# Altium project 2m_DBoard_TX.PrjPcb (part 1 of 2)
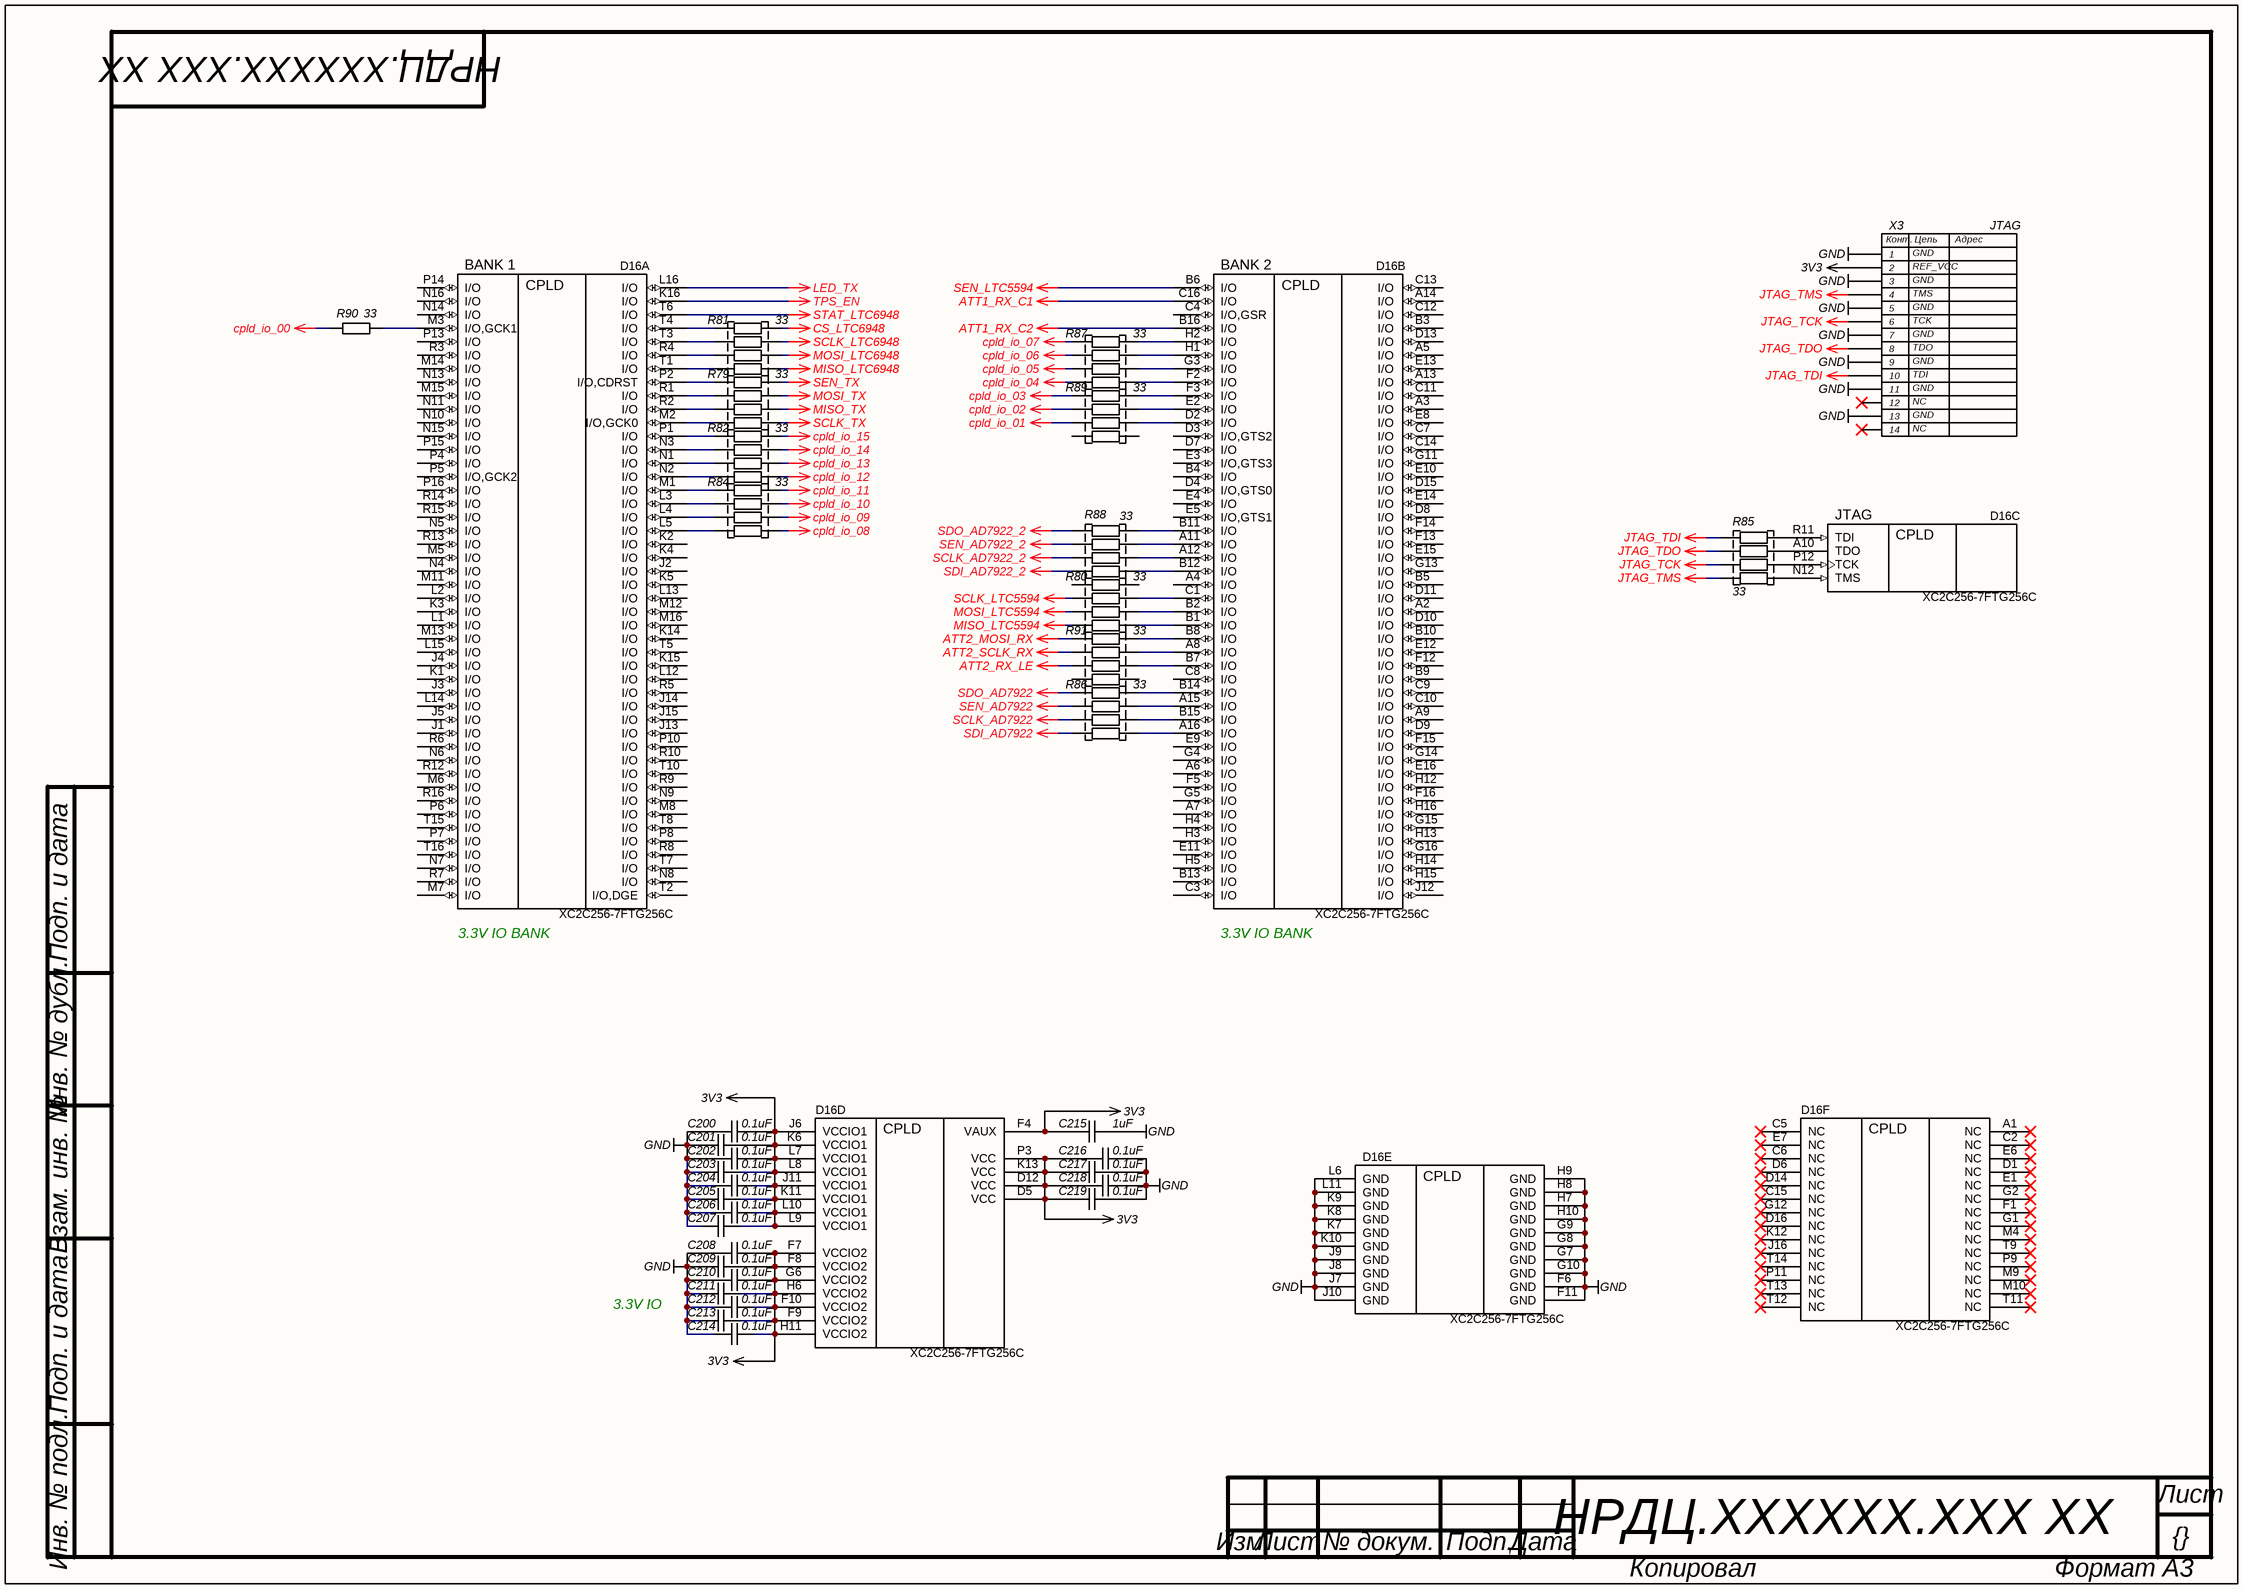
[diagram p0: CPLD.SchDoc]
7 sheets, 280 parts. Net scope: global (net labels, ports and power ports of the same name join across sheets).
Board file: 2m_DBoard_TX.PcbDoc
Sheets:
  CPLD.SchDoc
  DBoard_conn.SchDoc
  IF_TX.SchDoc
  TX.SchDoc
  REFCLK.SchDoc
  Digital.SchDoc
  Power.SchDoc

## Sheet CPLD.SchDoc: {Наименование}
size 420 x 297 mm; DocumentNumber: НРДЦ.ХХХХХХ.ХХХ ХХ; SheetNumber: {}; SheetTotal: {}; PageSetup: Record=PageOptions|CenterHorizontal=False|CenterVertical=False|PrintScale=0.95|XCorrection=0.00|YCorrection=0.00|PrintKind=1|BorderSize=5000000|LeftOffset=0|BottomOffset=0|Orientation=1|PaperLength=1000|PaperWidth=1000|Scale=100|PaperSource=15|PrintQuality=600|MediaType=1|DitherType=10|PaperKind=A4|PrintScaleMode=1; Rule: PcbType=ProtelPcb

### Parts
(Parts that share a designator on the sheet are numbered #1, #2 ... from top to bottom, then left to right.)
C200  value 0.1uF  [C0402]  (hidden comment: CAP)
C201  value 0.1uF  [C0402]  (hidden comment: CAP)
C202#1  value 0.1uF  [C0402]  (hidden comment: CAP)
C203#1  value 0.1uF  [C0402]  (hidden comment: CAP)
C204  value 0.1uF  [C0402]  (hidden comment: CAP)
C205  value 0.1uF  [C0402]  (hidden comment: CAP)
C206  value 0.1uF  [C0402]  (hidden comment: CAP)
C207  value 0.1uF  [C0402]  (hidden comment: CAP)
C208  value 0.1uF  [C0402]  (hidden comment: CAP)
C209  value 0.1uF  [C0402]  (hidden comment: CAP)
C210#1  value 0.1uF  [C0402]  (hidden comment: CAP)
C211#1  value 0.1uF  [C0402]  (hidden comment: CAP)
C212#1  value 0.1uF  [C0402]  (hidden comment: CAP)
C213  value 0.1uF  [C0402]  (hidden comment: CAP)
C214  value 0.1uF  [C0402]  (hidden comment: CAP)
C215  value 1uF  [C0402]  (hidden comment: CAP)
C216  value 0.1uF  [C0402]  (hidden comment: CAP)
C217  value 0.1uF  [C0402]  (hidden comment: CAP)
C218  value 0.1uF  [C0402]  (hidden comment: CAP)
C219  value 0.1uF  [C0402]  (hidden comment: CAP)
D16  XC2C256-7FTG256C  [FTG256]  (parts A,B,C,D,E,F of 6)
R79  value 33  [EXN8V]  (hidden comment: RES 4x0402)
R80  value 33  [EXN8V]  (hidden comment: RES 4x0402)
R81  value 33  [EXN8V]  (hidden comment: RES 4x0402)
R82  value 33  [EXN8V]  (hidden comment: RES 4x0402)
R84  value 33  [EXN8V]  (hidden comment: RES 4x0402)
R85  value 33  [EXN8V]  (hidden comment: RES 4x0402)
R86  value 33  [EXN8V]  (hidden comment: RES 4x0402)
R87  value 33  [EXN8V]  (hidden comment: RES 4x0402)
R88  value 33  [EXN8V]  (hidden comment: RES 4x0402)
R89  value 33  [EXN8V]  (hidden comment: RES 4x0402)
R90  value 33  [R0402]  (hidden comment: RES)
R91  value 33  [EXN8V]  (hidden comment: RES 4x0402)
X3  JTAG  [JTAG Mail 2mm]

### Nets
3V3: C200.2 C201.2 C202#1.2 C203#1.2 C204.2 C205.2 C206.2 C207.2 C208.2 C209.2 C210#1.2 C211#1.2 C212#1.2 C213.2 C214.2 C215.1 C216.1 C217.1 C218.1 C219.1 D16.D5(VCC) D16.D12(VCC) D16.F4(VAUX) D16.F7(VCCIO2) D16.F8(VCCIO2) D16.F9(VCCIO2) D16.F10(VCCIO2) D16.G6(VCCIO2) D16.H6(VCCIO2) D16.H11(VCCIO2) D16.J6(VCCIO1) D16.J11(VCCIO1) D16.K6(VCCIO1) D16.K11(VCCIO1) D16.K13(VCC) D16.L7(VCCIO1) D16.L8(VCCIO1) D16.L9(VCCIO1) D16.L10(VCCIO1) D16.P3(VCC) X3.2
ATT1_RX_C1: D16.C16(I/O)
ATT1_RX_C2: D16.B16(I/O)
ATT2_MOSI_RX: R91.5
ATT2_RX_LE: R91.7
ATT2_SCLK_RX: R91.6
cpld_io_00: R90.2
cpld_io_01: R89.6
cpld_io_02: R89.7
cpld_io_03: R89.8
cpld_io_04: R87.5
cpld_io_05: R87.6
cpld_io_06: R87.7
cpld_io_07: R87.8
cpld_io_08: R84.5
cpld_io_09: R84.6
cpld_io_10: R84.7
cpld_io_11: R84.8
cpld_io_12: R82.5
cpld_io_13: R82.6
cpld_io_14: R82.7
cpld_io_15: R82.8
CS_LTC6948: R81.8
GND: C200.1 C201.1 C202#1.1 C203#1.1 C204.1 C205.1 C206.1 C207.1 C208.1 C209.1 C210#1.1 C211#1.1 C212#1.1 C213.1 C214.1 C215.2 C216.2 C217.2 C218.2 C219.2 D16.F6(GND) D16.F11(GND) D16.G7(GND) D16.G8(GND) D16.G9(GND) D16.G10(GND) D16.H7(GND) D16.H8(GND) D16.H9(GND) D16.H10(GND) D16.J7(GND) D16.J8(GND) D16.J9(GND) D16.J10(GND) D16.K7(GND) D16.K8(GND) D16.K9(GND) D16.K10(GND) D16.L6(GND) D16.L11(GND) X3.1 X3.3 X3.5 X3.7 X3.9 X3.11 X3.13
JTAG_TCK: R85.6 X3.6
JTAG_TDI: R85.8 X3.10
JTAG_TDO: R85.7 X3.8
JTAG_TMS: R85.5 X3.4
LED_TX: D16.L16(I/O)
MISO_LTC5594: R80.5
MISO_LTC6948: R81.5
MISO_TX: R79.7
MOSI_LTC5594: R80.6
MOSI_LTC6948: R81.6
MOSI_TX: R79.6
SCLK_AD7922: R86.2
SCLK_AD7922_2: R88.6
SCLK_LTC5594: R80.7
SCLK_LTC6948: R81.7
SCLK_TX: R79.8
SDI_AD7922: R86.1
SDI_AD7922_2: R88.5
SDO_AD7922: R86.4
SDO_AD7922_2: R88.8
SEN_AD7922: R86.3
SEN_AD7922_2: R88.7
SEN_LTC5594: D16.B6(I/O)
SEN_TX: R79.5
STAT_LTC6948: D16.T6(I/O)
TPS_EN: D16.K16(I/O)
NetD16_A8: D16.A8(I/O) R91.3
NetD16_A10: D16.A10(TDO) R85.2
NetD16_A11: D16.A11(I/O) R88.1
NetD16_A12: D16.A12(I/O) R88.3
NetD16_A15: D16.A15(I/O) R86.6
NetD16_A16: D16.A16(I/O) R86.8
NetD16_B1: D16.B1(I/O) R80.4
NetD16_B2: D16.B2(I/O) R80.3
NetD16_B7: D16.B7(I/O) R91.2
NetD16_B8: D16.B8(I/O) R91.4
NetD16_B11: D16.B11(I/O) R88.2
NetD16_B12: D16.B12(I/O) R88.4
NetD16_B14: D16.B14(I/O) R86.5
NetD16_B15: D16.B15(I/O) R86.7
NetD16_C1: D16.C1(I/O) R80.2
NetD16_D2: D16.D2(I/O) R89.3
NetD16_E2: D16.E2(I/O) R89.2
NetD16_F2: D16.F2(I/O) R87.4
NetD16_F3: D16.F3(I/O) R89.1
NetD16_G3: D16.G3(I/O) R87.3
NetD16_H1: D16.H1(I/O) R87.2
NetD16_H2: D16.H2(I/O) R87.1
NetD16_L3: D16.L3(I/O) R84.2
NetD16_L4: D16.L4(I/O) R84.3
NetD16_L5: D16.L5(I/O) R84.4
NetD16_M1: D16.M1(I/O) R84.1
NetD16_M2: D16.M2(I/O,GCK0) R79.1
NetD16_M3: D16.M3(I/O,GCK1) R90.1
NetD16_N1: D16.N1(I/O) R82.3
NetD16_N2: D16.N2(I/O) R82.4
NetD16_N3: D16.N3(I/O) R82.2
NetD16_N12: D16.N12(TMS) R85.4
NetD16_P1: D16.P1(I/O) R82.1
NetD16_P2: D16.P2(I/O,CDRST) R79.4
NetD16_P12: D16.P12(TCK) R85.3
NetD16_R1: D16.R1(I/O) R79.3
NetD16_R2: D16.R2(I/O) R79.2
NetD16_R4: D16.R4(I/O) R81.2
NetD16_R11: D16.R11(TDI) R85.1
NetD16_T1: D16.T1(I/O) R81.4
NetD16_T3: D16.T3(I/O) R81.3
NetD16_T4: D16.T4(I/O) R81.1

Not connected (* = marked no-connect by the designer): D16 A1(NC)* A2(I/O) A3(I/O) A4(I/O) A5(I/O) A6(I/O) A7(I/O) A9(I/O) A13(I/O) A14(I/O) B3(I/O) B4(I/O) B5(I/O) B9(I/O) B10(I/O) B13(I/O) C2(NC)* C3(I/O) C4(I/O,GSR) C5(NC)* C6(NC)* C7(I/O) C8(I/O) C9(I/O) C10(I/O) C11(I/O) C12(I/O) C13(I/O) C14(I/O) C15(NC)* D1(NC)* D3(I/O,GTS2) D4(I/O,GTS0) D6(NC)* D7(I/O) D8(I/O) D9(I/O) D10(I/O) D11(I/O) D13(I/O) D14(NC)* D15(I/O) D16(NC)* E1(NC)* E3(I/O,GTS3) E4(I/O) E5(I/O,GTS1) E6(NC)* E7(NC)* E8(I/O) E9(I/O) E10(I/O) E11(I/O) E12(I/O) E13(I/O) E14(I/O) E15(I/O) E16(I/O) F1(NC)* F5(I/O) F12(I/O) F13(I/O) F14(I/O) F15(I/O) F16(I/O) G1(NC)* G2(NC)* G4(I/O) G5(I/O) G11(I/O) G12(NC)* G13(I/O) G14(I/O) G15(I/O) G16(I/O) H3(I/O) H4(I/O) H5(I/O) H12(I/O) H13(I/O) H14(I/O) H15(I/O) H16(I/O) J1(I/O) J2(I/O) J3(I/O) J4(I/O) J5(I/O) J12(I/O) J13(I/O) J14(I/O) J15(I/O) J16(NC)* K1(I/O) K2(I/O) K3(I/O) K4(I/O) K5(I/O) K12(NC)* K14(I/O) K15(I/O) L1(I/O) L2(I/O) L12(I/O) L13(I/O) L14(I/O) L15(I/O) M4(NC)* M5(I/O) M6(I/O) M7(I/O) M8(I/O) M9(NC)* M10(NC)* M11(I/O) M12(I/O) M13(I/O) M14(I/O) M15(I/O) M16(I/O) N4(I/O) N5(I/O) N6(I/O) N7(I/O) N8(I/O) N9(I/O) N10(I/O) N11(I/O) N13(I/O) N14(I/O) N15(I/O) N16(I/O) P4(I/O) P5(I/O,GCK2) P6(I/O) P7(I/O) P8(I/O) P9(NC)* P10(I/O) P11(NC)* P13(I/O) P14(I/O) P15(I/O) P16(I/O) R3(I/O) R5(I/O) R6(I/O) R7(I/O) R8(I/O) R9(I/O) R10(I/O) R12(I/O) R13(I/O) R14(I/O) R15(I/O) R16(I/O) T2(I/O,DGE) T5(I/O) T7(I/O) T8(I/O) T9(NC)* T10(I/O) T11(NC)* T12(NC)* T13(NC)* T14(NC)* T15(I/O) T16(I/O); R80 1 8; R89 4 5; R91 1 8; X3 12* 14*

### Notes on the sheet
- (near X3) GND
- (near X3) REF_VCC
- (near X3) TMS
- (near X3) TCK
- (near X3) TDO
- (near X3) TDI
- (near X3) NC
- (near D16) 3.3V IO BANK
- 3.3V IO
- Подп. и дата
- Инв. № дубл.
- Взам. инв. №
- Инв. № подл.
- Лист
- Изм.
- № докум.
- Подп.
- Дата
- Копировал
- Формат А3
- (in symbol HDR Debug_14-pin) Конт.; Цепь; Адрес
- (in symbol XC2C256-7FTG256C, part A) BANK 1
- (in symbol XC2C256-7FTG256C, part B) BANK 2
- (in symbol XC2C256-7FTG256C, part C) JTAG

### Library data of the parts
C200 C204 C208 C210#1 C212#1 C214 C216-C219 = CAP: SMD Capacitor; Manufacturer: Murata; Material: X7R; Tolerance: 10%; Voltage: 16V; Type: Ceramic Capacitor; P/N: GRM155R71C104KA88J
C201 C202#1 C203#1 C205-C207 C209 C211#1 C213 C215 = CAP: SMD Capacitor; Manufacturer: Murata; Material: X7R; Tolerance: 10%; Voltage: 6.3V; Type: Ceramic Capacitor; P/N: GRM155R70J105KA12J
D16 = XC2C256-7FTG256C: CoolRunner-II 1.8V, 256 Macrocell CPLD, 184 User I/Os, 256-Ball FTBGA, Commercial Grade, Pb-Free; Code_JEDEC: MS-034-AAF-1*; PackageVersion: ver1.3, Oct-2007; PackageReference: FTG256; PackageDescription: 256-Ball Fine Pitch Thin Ball Grid Array 1.00 mm Pitch (FTG256) - Pb-Free; DatasheetVersion: ver3.2, Mar-2007; PartNumber: XC2C256-7FTG256C; P/N: XC2C256-7FTG256C; Name: XC2C256-7FTG256C; Type: CPLD
R79-R82 R84-R89 R91 = RES 4x0402: Chip Resistor Array; Manufacturer: Panasonic; Name: EXBN8V; Number of Resistors: 4; Tolerance: 5%; P/N: ERJ-2GEJ330X; Type: 0402 Array Concave Terminal; Number of Terminals: 8; Series: EXB
R90 = RES: SMD Resistor; Manufacturer: Panasonic Electronic Components; Name: Chip SMD Resistor; Power: 0.2 Wt; P/N: ERJ-2RKF28R7X; Temperature Range: -55…155°C
X3 = HDR Debug_14-pin: 2.00mm Pitch, Milli-Grid PCB Header, Dual Row, Vertical, Through Hole, Shrouded, 14 / Circuits; Manufacturer: Molex; Name: Milli-Grid Connector System; P/N: 878311421; Type: 2.00mm Pitch, Milli-Grid PCB Header, Dual Row, Vertical, Through Hole, Shrouded, 14; Series: 87831

## Sheet DBoard_conn.SchDoc: {Наименование}
size 420 x 297 mm; DocumentNumber: ПЛАС.ХХХХХХ.ХХХ ХХ; SheetNumber: {}; SheetTotal: {}; PageSetup: Record=PageOptions|CenterHorizontal=False|CenterVertical=False|PrintScale=0.95|XCorrection=0.00|YCorrection=0.00|PrintKind=1|BorderSize=5000000|LeftOffset=0|BottomOffset=0|Orientation=1|PaperLength=1000|PaperWidth=1000|Scale=100|PaperSource=15|PrintQuality=600|MediaType=1|DitherType=10|PaperKind=A4|PrintScaleMode=1; Rule: PcbType=ProtelPcb
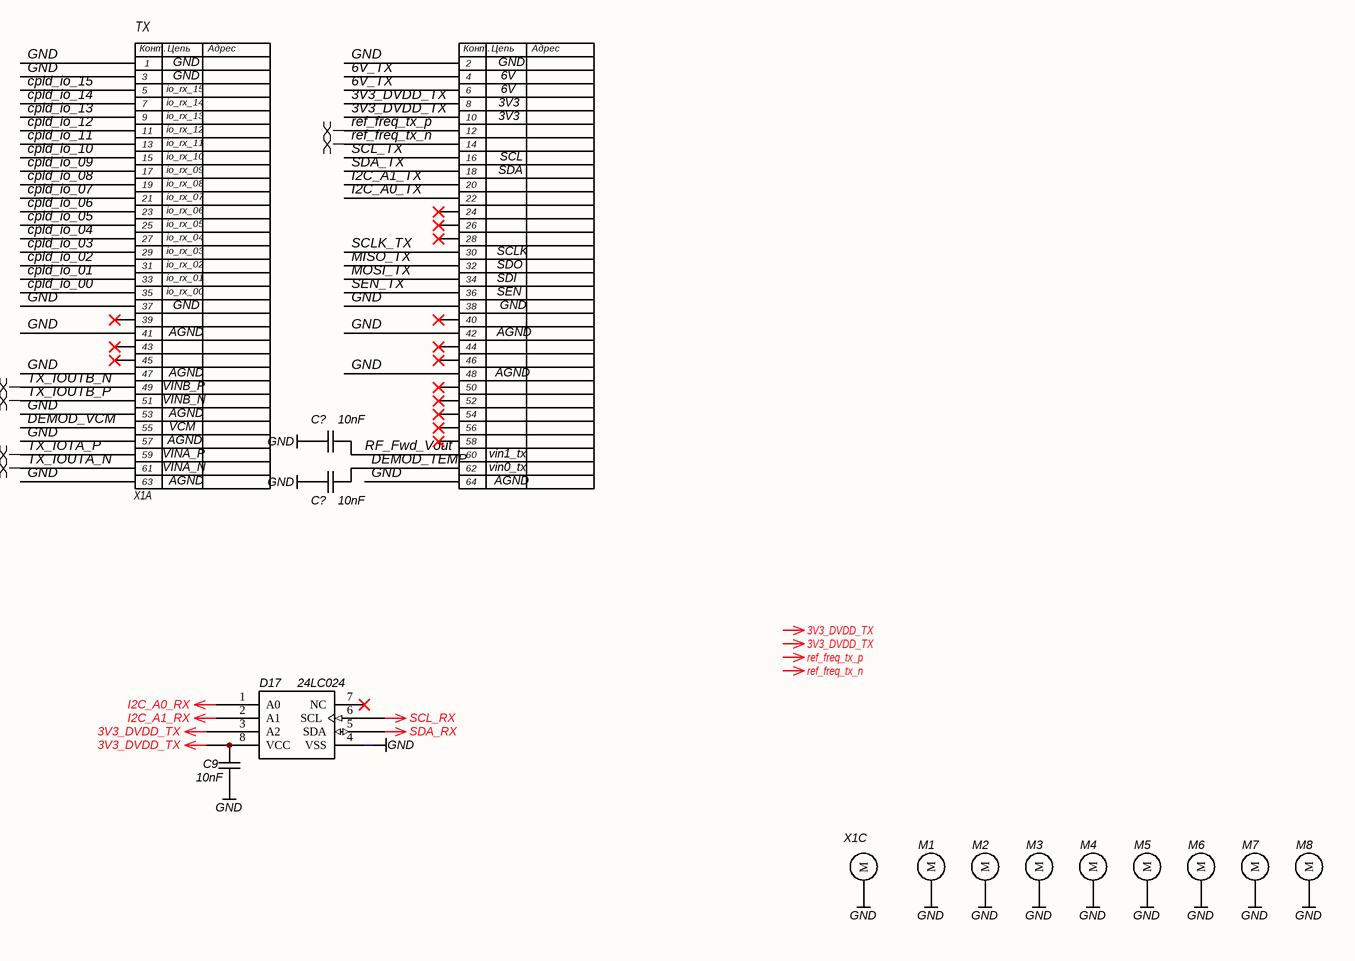
[diagram p1: DBoard_conn.SchDoc]

### Parts
(Parts that share a designator on the sheet are numbered #1, #2 ... from top to bottom, then left to right.)
C9  value 10nF  [C0402]  (hidden comment: CAP)
C?#1  value 10nF  [C0402]  (hidden comment: CAP)
C?#2  value 10nF  [C0402]  (hidden comment: CAP)
D17#1  24LC024  [SOIC_SN8]
M1  Via  [Mechanical_Via_2.6x4.2]  (value not drawn)
M2  Via  [Mechanical_Via_2.6x4.2]  (value not drawn)
M3  Via  [Mechanical_Via_2.6x4.2]  (value not drawn)
M4  Via  [Mechanical_Via_2.6x4.2]  (value not drawn)
M5  Via  [Mechanical_Via_2.6x4.2]  (value not drawn)
M6  Via  [Mechanical_Via_2.6x4.2]  (value not drawn)
M7  Via  [Mechanical_Via_2.6x4.2]  (value not drawn)
M8  Via  [Mechanical_Via_2.6x4.2]  (value not drawn)
X1  DBoard  [DBOARD-HALF-TX-MB]  (value not drawn)  (parts A,C of 3)

### Nets
3V3_DVDD_TX: C9.2 D17#1.3(A2) D17#1.8(VCC) X1.8 X1.10
6V_TX: X1.4 X1.6
cpld_io_00: X1.35
cpld_io_01: X1.33
cpld_io_02: X1.31
cpld_io_03: X1.29
cpld_io_04: X1.27
cpld_io_05: X1.25
cpld_io_06: X1.23
cpld_io_07: X1.21
cpld_io_08: X1.19
cpld_io_09: X1.17
cpld_io_10: X1.15
cpld_io_11: X1.13
cpld_io_12: X1.11
cpld_io_13: X1.9
cpld_io_14: X1.7
cpld_io_15: X1.5
GND: C9.1 C?#1.1 C?#2.1 D17#1.4(VSS) M1.0(M) M2.0(M) M3.0(M) M4.0(M) M5.0(M) M6.0(M) M7.0(M) M8.0(M) X1.0(M) X1.1 X1.2 X1.3 X1.37 X1.38 X1.41 X1.42 X1.47 X1.48 X1.53 X1.57 X1.63 X1.64
I2C_A0_RX: D17#1.1(A0)
I2C_A0_TX: X1.22
I2C_A1_RX: D17#1.2(A1)
I2C_A1_TX: X1.20
MISO_TX: X1.32
MOSI_TX: X1.34
ref_freq_tx_n: X1.14
ref_freq_tx_p: X1.12
SCL_RX: D17#1.6(SCL)
SCL_TX: X1.16
SCLK_TX: X1.30
SDA_RX: D17#1.5(SDA)
SDA_TX: X1.18
SEN_TX: X1.36
TX_IOUTA_N: X1.61
TX_IOUTB_N: X1.49
TX_IOUTB_P: X1.51
DEMOD_TEMP: C?#2.2 X1.62
DEMOD_VCM: X1.55
RF_Fwd_Vout: C?#1.2 X1.60
TX_IOTA_P: X1.59

Not connected (* = marked no-connect by the designer): D17#1 7(NC)*; X1 24* 26* 28* 39* 40* 43* 44* 45* 46* 50* 52* 54* 56* 58*

### Layout directives
differential pair: ref_freq_tx_n, ref_freq_tx_p, TX_IOTA_P, TX_IOUTA_N, TX_IOUTB_N, TX_IOUTB_P

### Notes on the sheet
- (near X1) io_rx_15
- (near X1) io_rx_14
- (near X1) GND
- (near X1) 3V3
- (near X1) 6V
- (near X1) io_rx_13
- (near X1) io_rx_12
- (near X1) io_rx_11
- (near X1) io_rx_10
- (near X1) io_rx_09
- (near X1) SDA
- (near X1) SCL
- (near X1) io_rx_08
- (near X1) io_rx_07
- (near X1) io_rx_06
- (near X1) io_rx_05
- (near X1) io_rx_04
- (near X1) io_rx_03
- (near X1) io_rx_02
- (near X1) io_rx_01
- (near X1) io_rx_00
- (near X1) SCLK
- (near X1) SDO
- (near X1) SDI
- (near X1) SEN
- (near X1) AGND
- (near X1) VINB_P
- (near X1) VINB_N
- (near X1) VCM
- (near X1) VINA_P
- (near X1) VINA_N
- (near X1) vin1_tx
- (near X1) vin0_tx
- Labels drawn without touching a wire or pin: 3V3_DVDD_TX, ref_freq_tx_n, ref_freq_tx_p
- Подп. и дата
- Инв. № дубл.
- Взам. инв. №
- Инв. № подл.
- Лист
- Изм.
- № докум.
- Подп.
- Дата
- Копировал
- Формат А3
- (in symbol DBoard, part A) TX; Конт.; Цепь; Адрес
- (in symbol DBoard, part B) RX; Конт.; Цепь; Адрес

### Library data of the parts
C9 C?#1 C?#2 = CAP: SMD Capacitor; Manufacturer: Murata; Material: X7R; Tolerance: 10%; Voltage: 25V; Type: Ceramic Capacitor; P/N: GRM155R71E103KA01D
D17#1 = 24LC024: I2C EEPROM; Manufacturer: Microchip; Capacity: 2kbit; Max Clock: 400 kHz; Voltage: 2.5-5.5V; P/N: 24LC024HT-I/SN; Name: 24LC024; Package: SOIC-8; Type: I2C EEPROM; Value: 24LC024
M1-M8 = Mechanical Via
X1 = DBoard: USRP DBoard; Manufacturer: Molex; Name: 1.00mm Pitch Mezzanine 714390164; P/N: 714390164; Supplier 1: Digi-Key; Supplier Part Number 1: WM17201-ND

## Sheet IF_TX.SchDoc: {Наименование}
size 420 x 297 mm; DocumentNumber: ПЛАС.ХХХХХХ.ХХХ ХХ; SheetNumber: {}; SheetTotal: {}; PageSetup: Record=PageOptions|CenterHorizontal=False|CenterVertical=False|PrintScale=0.95|XCorrection=0.00|YCorrection=0.00|PrintKind=1|BorderSize=5000000|LeftOffset=0|BottomOffset=0|Orientation=1|PaperLength=1000|PaperWidth=1000|Scale=100|PaperSource=15|PrintQuality=600|MediaType=1|DitherType=10|PaperKind=A4|PrintScaleMode=1; Rule: PcbType=ProtelPcb
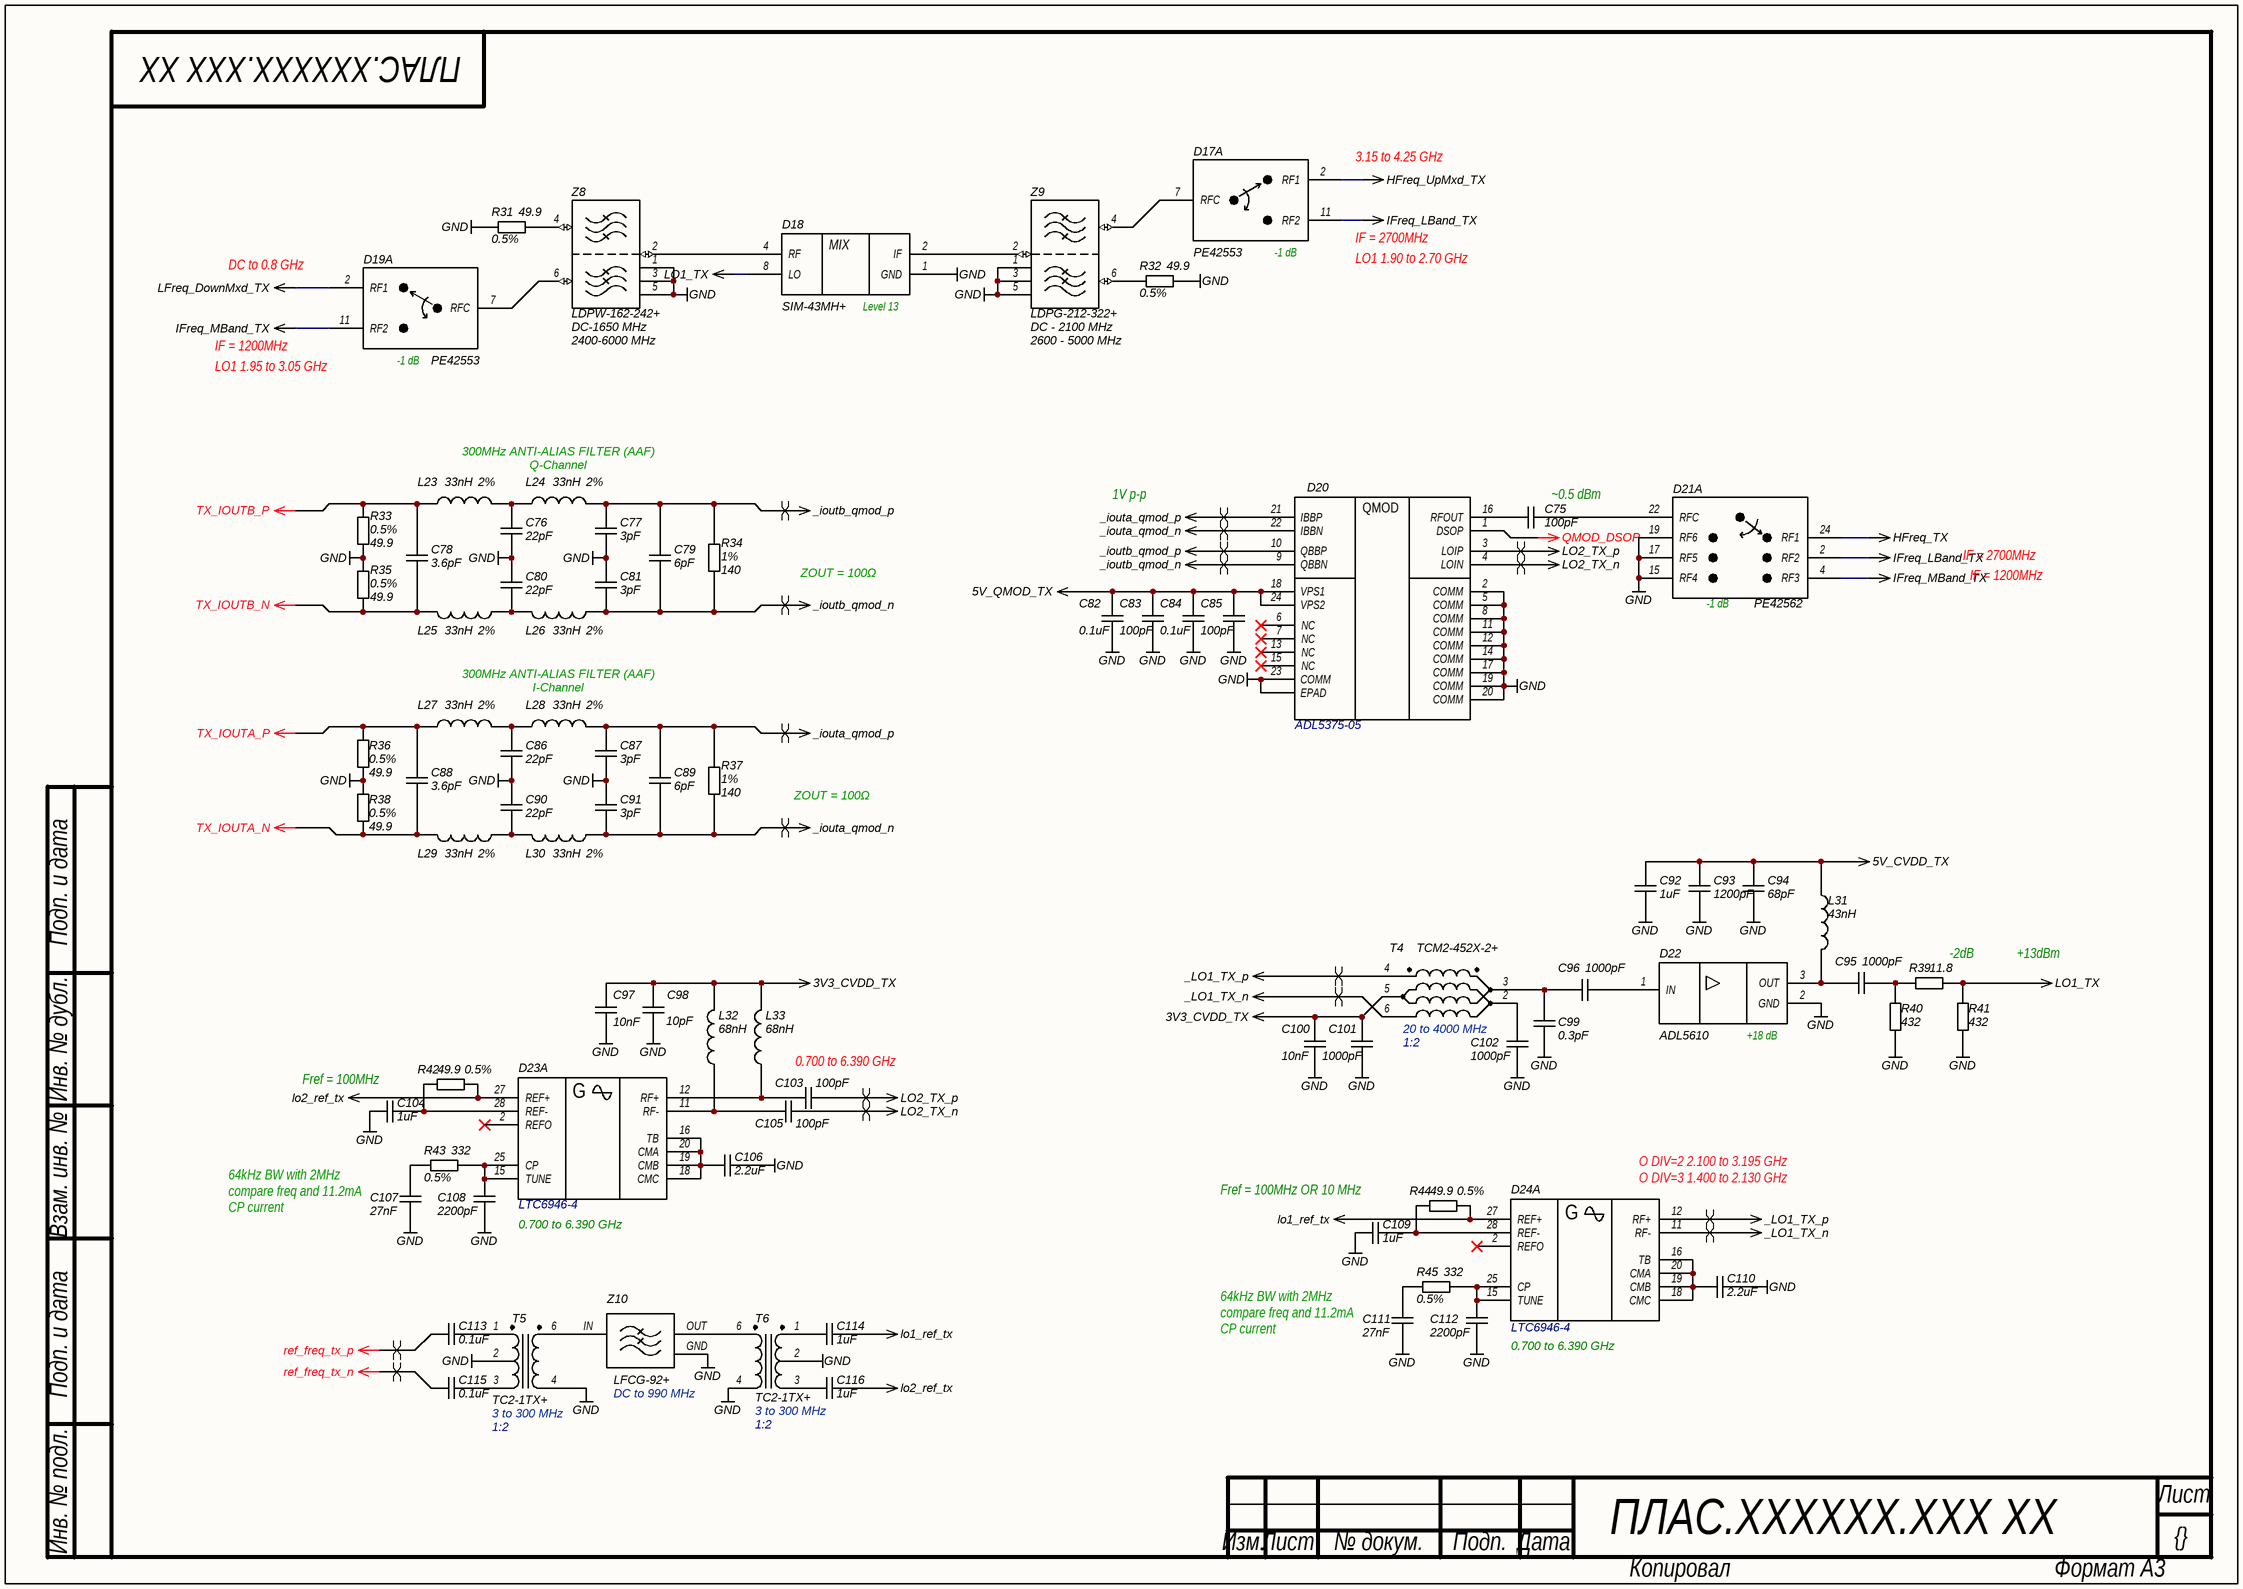
[diagram p2: IF_TX.SchDoc]

### Parts
(Parts that share a designator on the sheet are numbered #1, #2 ... from top to bottom, then left to right.)
C75  value 100pF  [C0402]  (hidden comment: CAP)
C76  value 22pF  [C0402]  (hidden comment: CAP)
C77  value 3pF  [C0402]  (hidden comment: CAP)
C78  value 3.6pF  [C0402]  (hidden comment: CAP)
C79  value 6pF  [C0402]  (hidden comment: CAP)
C80  value 22pF  [C0402]  (hidden comment: CAP)
C81  value 3pF  [C0402]  (hidden comment: CAP)
C82  value 0.1uF  [C0402]  (hidden comment: CAP)
C83  value 100pF  [C0402]  (hidden comment: CAP)
C84  value 0.1uF  [C0402]  (hidden comment: CAP)
C85  value 100pF  [C0402]  (hidden comment: CAP)
C86  value 22pF  [C0402]  (hidden comment: CAP)
C87  value 3pF  [C0402]  (hidden comment: CAP)
C88  value 3.6pF  [C0402]  (hidden comment: CAP)
C89  value 6pF  [C0402]  (hidden comment: CAP)
C90  value 22pF  [C0402]  (hidden comment: CAP)
C91  value 3pF  [C0402]  (hidden comment: CAP)
C92  value 1uF  [C0805]  (hidden comment: CAP)
C93  value 1200pF  [C0603]  (hidden comment: CAP)
C94  value 68pF  [C0402]  (hidden comment: CAP)
C95  value 1000pF  [C0402]  (hidden comment: CAP)
C96  value 1000pF  [C0402]  (hidden comment: CAP)
C97  value 10nF  [C0402]  (hidden comment: CAP)
C98  value 10pF  [C0402]  (hidden comment: CAP)
C99  value 0.3pF  [C0402]  (hidden comment: CAP)
C100  value 10nF  [C0402]  (hidden comment: CAP)
C101  value 1000pF  [C0402]  (hidden comment: CAP)
C102  value 1000pF  [C0402]  (hidden comment: CAP)
C103  value 100pF  [C0402]  (hidden comment: CAP)
C104  value 1uF  [C0805]  (hidden comment: CAP)
C105  value 100pF  [C0402]  (hidden comment: CAP)
C106  value 2.2uF  [C0603]  (hidden comment: CAP)
C107  value 27nF  [C1206]  (hidden comment: CAP)
C108  value 2200pF  [C0603]  (hidden comment: CAP)
C109  value 1uF  [C0805]  (hidden comment: CAP)
C110  value 2.2uF  [C0603]  (hidden comment: CAP)
C111  value 27nF  [C1206]  (hidden comment: CAP)
C112  value 2200pF  [C0603]  (hidden comment: CAP)
C113  value 0.1uF  [C0402]  (hidden comment: CAP)
C114  value 1uF  [C0805]  (hidden comment: CAP)
C115  value 0.1uF  [C0402]  (hidden comment: CAP)
C116  value 1uF  [C0805]  (hidden comment: CAP)
D17#2  PE42553  [QFN-16]  (part A of 2)
D18  SIM-43MH+  [SIM-43MH+]
D19  PE42553  [QFN-16]  (part A of 2)
D20  Name: ADL5375-05  [LFCSP-24]  (hidden comment: ADL5375)
D21  PE42562  [QFN-24]  (part A of 2)
D22  ADL5610  [ADL5610]
D23  Name: LTC6946-4  Frequency Range: 0.700 to 6.390 GHz  [QFN-28]  (hidden comment: LTC6946)  (part A of 2)
D24  Name: LTC6946-4  Frequency Range: 0.700 to 6.390 GHz  [QFN-28]  (hidden comment: LTC6946)  (part A of 2)
L23  value 33nH  Tolerance: 2%  [L0603_HP]  (hidden comment: Inductor RF)
L24  value 33nH  Tolerance: 2%  [L0603_HP]  (hidden comment: Inductor RF)
L25  value 33nH  Tolerance: 2%  [L0603_HP]  (hidden comment: Inductor RF)
L26  value 33nH  Tolerance: 2%  [L0603_HP]  (hidden comment: Inductor RF)
L27  value 33nH  Tolerance: 2%  [L0603_HP]  (hidden comment: Inductor RF)
L28  value 33nH  Tolerance: 2%  [L0603_HP]  (hidden comment: Inductor RF)
L29  value 33nH  Tolerance: 2%  [L0603_HP]  (hidden comment: Inductor RF)
L30  value 33nH  Tolerance: 2%  [L0603_HP]  (hidden comment: Inductor RF)
L31  value 43nH  [L0603_HP]  (hidden comment: Inductor RF)
L32  value 68nH  [L0603_HP]  (hidden comment: Inductor RF)
L33  value 68nH  [L0603_HP]  (hidden comment: Inductor RF)
R31  value 49.9  Tolerance: 0.5%  [R0402]  (hidden comment: RES)
R32  value 49.9  Tolerance: 0.5%  [R0402]  (hidden comment: RES)
R33  value 49.9  Tolerance: 0.5%  [R0402]  (hidden comment: RES)
R34  value 140  Tolerance: 1%  [R0402]  (hidden comment: RES)
R35  value 49.9  Tolerance: 0.5%  [R0402]  (hidden comment: RES)
R36  value 49.9  Tolerance: 0.5%  [R0402]  (hidden comment: RES)
R37  value 140  Tolerance: 1%  [R0402]  (hidden comment: RES)
R38  value 49.9  Tolerance: 0.5%  [R0402]  (hidden comment: RES)
R39  value 11.8  [R0402]  (hidden comment: RES)
R40  value 432  [R0402]  (hidden comment: RES)
R41  value 432  [R0402]  (hidden comment: RES)
R42  value 49.9  Tolerance: 0.5%  [R0402]  (hidden comment: RES)
R43  value 332  Tolerance: 0.5%  [R0603]  (hidden comment: RES)
R44  value 49.9  Tolerance: 0.5%  [R0402]  (hidden comment: RES)
R45  value 332  Tolerance: 0.5%  [R0603]  (hidden comment: RES)
T4  TCM2-452X-2+  Frequency: 20 to 4000 MHz  Ratio: 1:2  [DB1627]
T5  TC2-1TX+  Frequency: 3 to 300 MHz  Ratio: 1:2  [AT1521]
T6  TC2-1TX+  Frequency: 3 to 300 MHz  Ratio: 1:2  [AT1521]
Z8  LDPW-162-242+  Low Pass: DC-1650 MHz  High Pass: 2400-6000 MHz  [JC0603C]
Z9  LDPG-212-322+  Low Pass: DC - 2100 MHz  High Pass: 2600 - 5000 MHz  [GE0805C-10]
Z10  LFCG-92+  Frequency: DC to 990 MHz  [GE0805C-2]

### Nets
3V3_CVDD_TX: C97.2 C98.2 C100.2 C101.1 L32.2 L33.2 T4.5
5V_CVDD_TX: C92.1 C93.2 C94.2 L31.2
5V_QMOD_TX: C82.2 C83.2 C84.2 C85.2 D20.18(VPS1) D20.24(VPS2)
_iouta_qmod_n: C89.2 C91.2 D20.22(IBBN) L30.2 R37.2
_iouta_qmod_p: C87.1 C89.1 D20.21(IBBP) L28.2 R37.1
_ioutb_qmod_n: C79.2 C81.2 D20.9(QBBN) L26.2 R34.2
_ioutb_qmod_p: C77.1 C79.1 D20.10(QBBP) L24.2 R34.1
_LO1_TX_n: D24.11(RF-) T4.6
_LO1_TX_p: D24.12(RF+) T4.4
GND: C76.2 C77.2 C80.1 C81.1 C82.1 C83.1 C84.1 C85.1 C86.2 C87.2 C90.1 C91.1 C92.2 C93.1 C94.1 C97.1 C98.1 C99.1 C100.1 C101.2 C102.2 C104.2 C106.1 C107.1 C108.1 C109.2 C110.1 C111.1 C112.1 D18.1(GND) D20.2(COMM) D20.5(COMM) D20.8(COMM) D20.11(COMM) D20.12(COMM) D20.14(COMM) D20.17(COMM) D20.19(COMM) D20.20(COMM) D20.23(COMM) D20.25(EPAD) D21.15(RF4) D21.17(RF5) D21.19(RF6) D22.2(GND) R31.1 R32.1 R33.2 R35.1 R36.2 R38.1 R40.2 R41.2 T5.2 T5.4 T6.2 T6.4 Z8.1(GND) Z8.3(GND) Z8.5(GND) Z9.1(GND) Z9.3(GND) Z9.5(GND) Z10.GND
HFreq_TX: D21.24(RF1)
HFreq_UpMxd_TX: D17#2.2(RF1)
IFreq_LBand_TX: D17#2.11(RF2) D21.2(RF2)
IFreq_MBand_TX: D19.11(RF2) D21.4(RF3)
LFreq_DownMxd_TX: D19.2(RF1)
lo1_ref_tx: C114.1 D24.27(REF+) R44.1
LO1_TX: D18.8(LO) R39.1 R41.1
lo2_ref_tx: C116.1 D23.27(REF+) R42.1
LO2_TX_n: C105.2 D20.4(LOIN)
LO2_TX_p: C103.2 D20.3(LOIP)
QMOD_DSOP: D20.1(DSOP)
ref_freq_tx_n: C115.2
ref_freq_tx_p: C113.2
TX_IOUTA_N: C88.2 L29.1 R38.2
TX_IOUTA_P: C88.1 L27.1 R36.1
TX_IOUTB_N: C78.2 L25.1 R35.2
TX_IOUTB_P: C78.1 L23.1 R33.1
NetC75_1: C75.1 D20.16(RFOUT)
NetC75_2: C75.2 D21.22(RFC)
NetC76_1: C76.1 L23.2 L24.1
NetC80_2: C80.2 L25.2 L26.1
NetC86_1: C86.1 L27.2 L28.1
NetC90_2: C90.2 L29.2 L30.1
NetC95_1: C95.1 D22.3(OUT) L31.1
NetC95_2: C95.2 R39.2 R40.1
NetC96_1: C96.1 C99.2 T4.3
NetC96_2: C96.2 D22.1(IN)
NetC102_1: C102.1 T4.2
NetC103_1: C103.1 D23.12(RF+) L33.1
NetC104_1: C104.1 D23.28(REF-) R42.2
NetC105_1: C105.1 D23.11(RF-) L32.1
NetC106_2: C106.2 D23.16(TB) D23.18(CMC) D23.19(CMB) D23.20(CMA)
NetC107_2: C107.2 R43.2
NetC108_2: C108.2 D23.15(TUNE) D23.25(CP) R43.1
NetC109_1: C109.1 D24.28(REF-) R44.2
NetC110_2: C110.2 D24.16(TB) D24.18(CMC) D24.19(CMB) D24.20(CMA)
NetC111_2: C111.2 R45.2
NetC112_2: C112.2 D24.15(TUNE) D24.25(CP) R45.1
NetC113_1: C113.1 T5.1
NetC114_2: C114.2 T6.1
NetC115_1: C115.1 T5.3
NetC116_2: C116.2 T6.3
NetD17#2_7: D17#2.7(RFC) Z9.4
NetD18_2: D18.2(IF) Z9.2
NetD18_4: D18.4(RF) Z8.2
NetD19_7: D19.7(RFC) Z8.6
NetR31_2: R31.2 Z8.4
NetR32_2: R32.2 Z9.6
NetT5_6: T5.6 Z10.IN
NetT6_6: T6.6 Z10.OUT

Not connected (* = marked no-connect by the designer): D20 6(NC)* 7(NC)* 13(NC)* 15(NC)*; D23 2(REFO)*; D24 2(REFO)*

### Layout directives
differential pair: _iouta_qmod_n, _iouta_qmod_p, _ioutb_qmod_n, _ioutb_qmod_p, _LO1_TX_n, _LO1_TX_p, LO2_TX_n, LO2_TX_p, ref_freq_tx_n, ref_freq_tx_p

### Notes on the sheet
- (near D17#2) 3.15 to 4.25 GHz
- (near D17#2) IF = 2700MHz
- LO1 1.90 to 2.70 GHz
- (near D19) DC to 0.8 GHz
- IF = 1200MHz
- (near D19) LO1 1.95 to 3.05 GHz
- 300MHz ANTI-ALIAS FILTER (AAF) Q-Channel
- 1V p-p
- (near C75) ~0.5 dBm
- ZOUT = 100Ω
- IF = 2700MHz
- 300MHz ANTI-ALIAS FILTER (AAF) I-Channel
- (near R39) -2dB
- +13dBm
- 0.700 to 6.390 GHz
- (near C104) Fref = 100MHz
- Fref = 100MHz OR 10 MHz
- (near D24) O DIV=2 2.100 to 3.195 GHz
  O DIV=3 1.400 to 2.130 GHz
- 64kHz BW with 2MHz compare freq and 11.2mA CP current
- Подп. и дата
- Инв. № дубл.
- Взам. инв. №
- Инв. № подл.
- Лист
- Изм.
- № докум.
- Подп.
- Дата
- Копировал
- Формат А3
- (in symbol ADL5375) QMOD
- (in symbol ADL5610) +18 dB
- (in symbol LTC6946, part A) G
- (in symbol PE42553, part A) -1 dB
- (in symbol PE42562, part A) -1 dB
- (in symbol SIM-43MH+) MIX; Level 13

### Library data of the parts
C75 C83 C85 C103 C105 = CAP: SMD Capacitor; Manufacturer: Murata; Material: NP0; Tolerance: 1%; Voltage: 50V; Type: Ceramic Capacitor; P/N: GRM1555C1H101FA01D
C76 C80 C86 C90 = CAP: SMD Capacitor; Manufacturer: Murata; Material: NP0; Tolerance: 1%; Voltage: 50V; Type: Ceramic Capacitor; P/N: GRM1555C1H220FA01D
C77 C81 C87 C91 = CAP: SMD Capacitor; Manufacturer: Murata; Material: NP0; Tolerance: ±0.25pF; Voltage: 50V; Type: Ceramic Capacitor; P/N: GRM1555C1H3R0CA01D
C78 C88 = CAP: SMD Capacitor; Manufacturer: Murata; Material: NP0; Tolerance: ±0.25pF; Voltage: 50V; Type: Ceramic Capacitor; P/N: GRM1555C1H3R6CA01D
C79 C89 = CAP: SMD Capacitor; Manufacturer: Murata; Material: NP0; Tolerance: ±0.5pF; Voltage: 50V; Type: Ceramic Capacitor; P/N: GRM1555C1H6R0DA01D
C82 C84 C113 C115 = CAP: SMD Capacitor; Manufacturer: Murata; Material: X7R; Tolerance: 10%; Voltage: 10V; Type: Ceramic Capacitor; P/N: GRM155R71A104KA01J
C92 C104 C109 C114 C116 = CAP: SMD Capacitor; Manufacturer: Murata; Material: X7R; Tolerance: 10%; Voltage: 10V; Type: Ceramic Capacitor; P/N: GRM21BR71A105KA01K
C93 = CAP: SMD Capacitor; Manufacturer: Murata; Material: NP0; Tolerance: ±2%; Voltage: 50V; Type: Ceramic Capacitor; P/N: GRM1885C1H122GA01D
C94 = CAP: SMD Capacitor; Manufacturer: Murata; Material: NP0; Tolerance: ±1%; Voltage: 50V; Type: Ceramic Capacitor; P/N: GRM1555C1H680FA01D
C95 C96 C101 C102 = CAP: SMD Capacitor; Manufacturer: Murata; Material: NP0; Tolerance: 5%; Voltage: 50V; Type: Ceramic Capacitor; P/N: GRM1555C1H102JA01D
C97 C100 = CAP: as C9 on sheet DBoard_conn
C98 = CAP: SMD Capacitor; Manufacturer: Murata; Material: NP0; Tolerance: 1%; Voltage: 50V; Type: Ceramic Capacitor; P/N: GRM1555C1H100FA01D
C99 = CAP: SMD Capacitor; Manufacturer: Murata; Material: NP0; Tolerance: ±0.05pF; Voltage: 50V; Type: Ceramic Capacitor; P/N: GRM1555C1HR30WA01D
C106 C110 = CAP: SMD Capacitor; Manufacturer: Murata; Material: X7R; Tolerance: 10%; Voltage: 10V; Type: Ceramic Capacitor; P/N: GRM188R71A225KE15J
C107 C111 = CAP: SMD Capacitor; Manufacturer: Murata; Material: NP0; Tolerance: ±5%; Voltage: 50V; Type: Ceramic Capacitor; P/N: GRM3195C1H273JA01D
C108 C112 = CAP: SMD Capacitor; Manufacturer: Murata; Material: NP0; Tolerance: 1%; Voltage: 50V; Type: Ceramic Capacitor; P/N: GRM1885C1H222FA01D
D17#2 D19 = PE42553: HaRPTM technology-enhanced absorptive SPDT; Manufacturer: Peregrine Technical Solutions; P/N: PE42553A-Z; Type: SPDT RF Switch; Name: PE42553; Package: 16-lead 3 × 3 mm QFN; Supplier 1: Digi-Key; Supplier Part Number 1: 1046-1137-1-ND
D18 = SIM-43MH+: Frequency Mixer; Manufacturer: Mini-Circuits; Power Level: +13dBm; Name: SIM-43MH+; Package: HV1195; Type: Frequency Mixer; P/N: SIM-43MH+
D20 = ADL5375: Broadband Quadrature Modulator; Manufacturer: Analog Devices; Voltage: 4.75 V to 5.25 V; P/N: ADL5375-05SCPZEPR7; Package: 24-lead LFCSP_VQ package; Temperature Range: –40°C to 125°C; Type: Broadband Quadrature Modulator; Supplier 1: Digi-Key; Supplier Part Number 1: ADL5375-05ACPZ-R7CT-ND
D21 = PE42562: The PE42582 is a HaRP™ technology-enhanced absorptive SP6T RF switch; Manufacturer: Peregrine Technical Solutions; P/N: PE42562A-X; Name: PE42562; Package: 24-lead 4 × 4 × 0.85 mm QFN; Type: Absorptive SP6T RF switch
D22 = ADL5610: RF/IF Gain Block; Manufacturer: Analog Devices; P/N: ADL5610ARKZ-R7; Name: ADL5610; Package: SOT89; Type: RF/IF Gain Block; Supplier 1: Digi-Key; Supplier Part Number 1: ADL5610ARKZ-R7CT-ND
D23 D24 = LTC6946: The LTC®6946 is a high performance, low noise, 6.39GHz  phase-locked loop (PLL); Manufacturer: Linear Technology; Voltage: 3.15 V ~ 5.25 V; Type: Clock/Frequency Synthesizer (RF/IF), Integer N; P/N: LTC6946IUFD-4#PBF; Package: 28-QFN (4x5); Temperature Range: -40°C ~ 105°C; Supplier 1: Digi-Key; Supplier Part Number 1: LTC6946IUFD-4#PBF-ND
L23-L30 = Inductor RF: Chip SMD Inductor; Manufacturer: Coilcraft; Current: 680mA; Frequency: 2.70GHz; Name: 0603HP-33NXGE; Series: 0603HP; Temperature Range: -25…85°C; P/N: 0603HP-33NXGE
L31 = Inductor RF: Chip SMD Inductor; Manufacturer: Coilcraft; Current: 810mA; Frequency: 2.45GHz; Name: 0603HP-43NXJE; Tolerance: 5%; Series: 0603HP; Temperature Range: -25…85°C; P/N: 0603HP-43NXJE
L32 L33 = Inductor RF: Chip SMD Inductor; Manufacturer: Coilcraft; Current: 600mA; Frequency: 2.00GHz; Name: 0603HP-68NXJE; Tolerance: 5%; Series: 0603HP; Temperature Range: -25…85°C; P/N: 0603HP-68NXJE
R31-R33 R35 R36 R38 R42 R44 = RES: SMD Resistor; Manufacturer: Panasonic Electronic Components; Name: Chip SMD Resistor; Power: 0.063 Wt; P/N: ERJ-2RKD49R9X; Temperature Range: -55…155°C
R34 R37 = RES: SMD Resistor; Manufacturer: Panasonic Electronic Components; Name: Chip SMD Resistor; Power: 0.1 Wt; P/N: ERJ-2RKF1400X; Temperature Range: -55…155°C
R39 = RES: SMD Resistor; Manufacturer: Panasonic Electronic Components; Name: Chip SMD Resistor; Power: 0.063 Wt; Tolerance: ±1%; P/N: ERJ-2RKF11R8X; Temperature Range: -55…155°C
R40 R41 = RES: SMD Resistor; Manufacturer: Panasonic Electronic Components; Name: Chip SMD Resistor; Power: 0.1 Wt; Tolerance: ±1%; P/N: ERJ-2RKF4320X; Temperature Range: -55…155°C
R43 R45 = RES: SMD Resistor; Manufacturer: Panasonic Electronic Components; Name: Chip SMD Resistor; Power: 0.2 Wt; P/N: ERJ-PB3D3320V; Temperature Range: -55…155°C
T4 = TCM2-452X-2+: RF Transformer; Manufacturer: Mini-Circuits; Name: TCM2-452X-2+; P/N: TCM2-452X-2+; Type: RF Transformer; Package: DB1627
T5 T6 = TC2-1TX+: RF Transformer; Manufacturer: Mini-Circuits; Name: TC2-1TX+; P/N: TC2-1TX+; Type: RF Transformer; Package: AT1521
Z8 = LDPW-162-242+: Diplexer; Manufacturer: Mini-Circuits; Frequency: DC to 6000 MHz; Name: LDPW-162-242+; P/N: LDPW-162-242+; Type: Diplexer; Package: JC0603C
Z9 = LDPG-212-322+: Diplexer; Manufacturer: Mini-Circuits; Frequency: DC to 5000 MHz; Name: LDPG-212-322+; P/N: LDPG-212-322+; Type: Diplexer; Package: GE0805C-10
Z10 = LFCG-92+: Low Pass Filter; Manufacturer: Mini-Circuits; Name: LFCG-92+; P/N: LFCG-92+; Type: Low Pass Filter; Package: GE0805C-2

## Sheet TX.SchDoc: {Наименование}
size 420 x 297 mm; DocumentNumber: ПЛАС.ХХХХХХ.ХХХ ХХ; SheetNumber: {}; SheetTotal: {}; PageSetup: Record=PageOptions|CenterHorizontal=False|CenterVertical=False|PrintScale=0.95|XCorrection=0.00|YCorrection=0.00|PrintKind=1|BorderSize=5000000|LeftOffset=0|BottomOffset=0|Orientation=1|PaperLength=1000|PaperWidth=1000|Scale=100|PaperSource=15|PrintQuality=600|MediaType=1|DitherType=10|PaperKind=A4|PrintScaleMode=1; Rule: PcbType=ProtelPcb
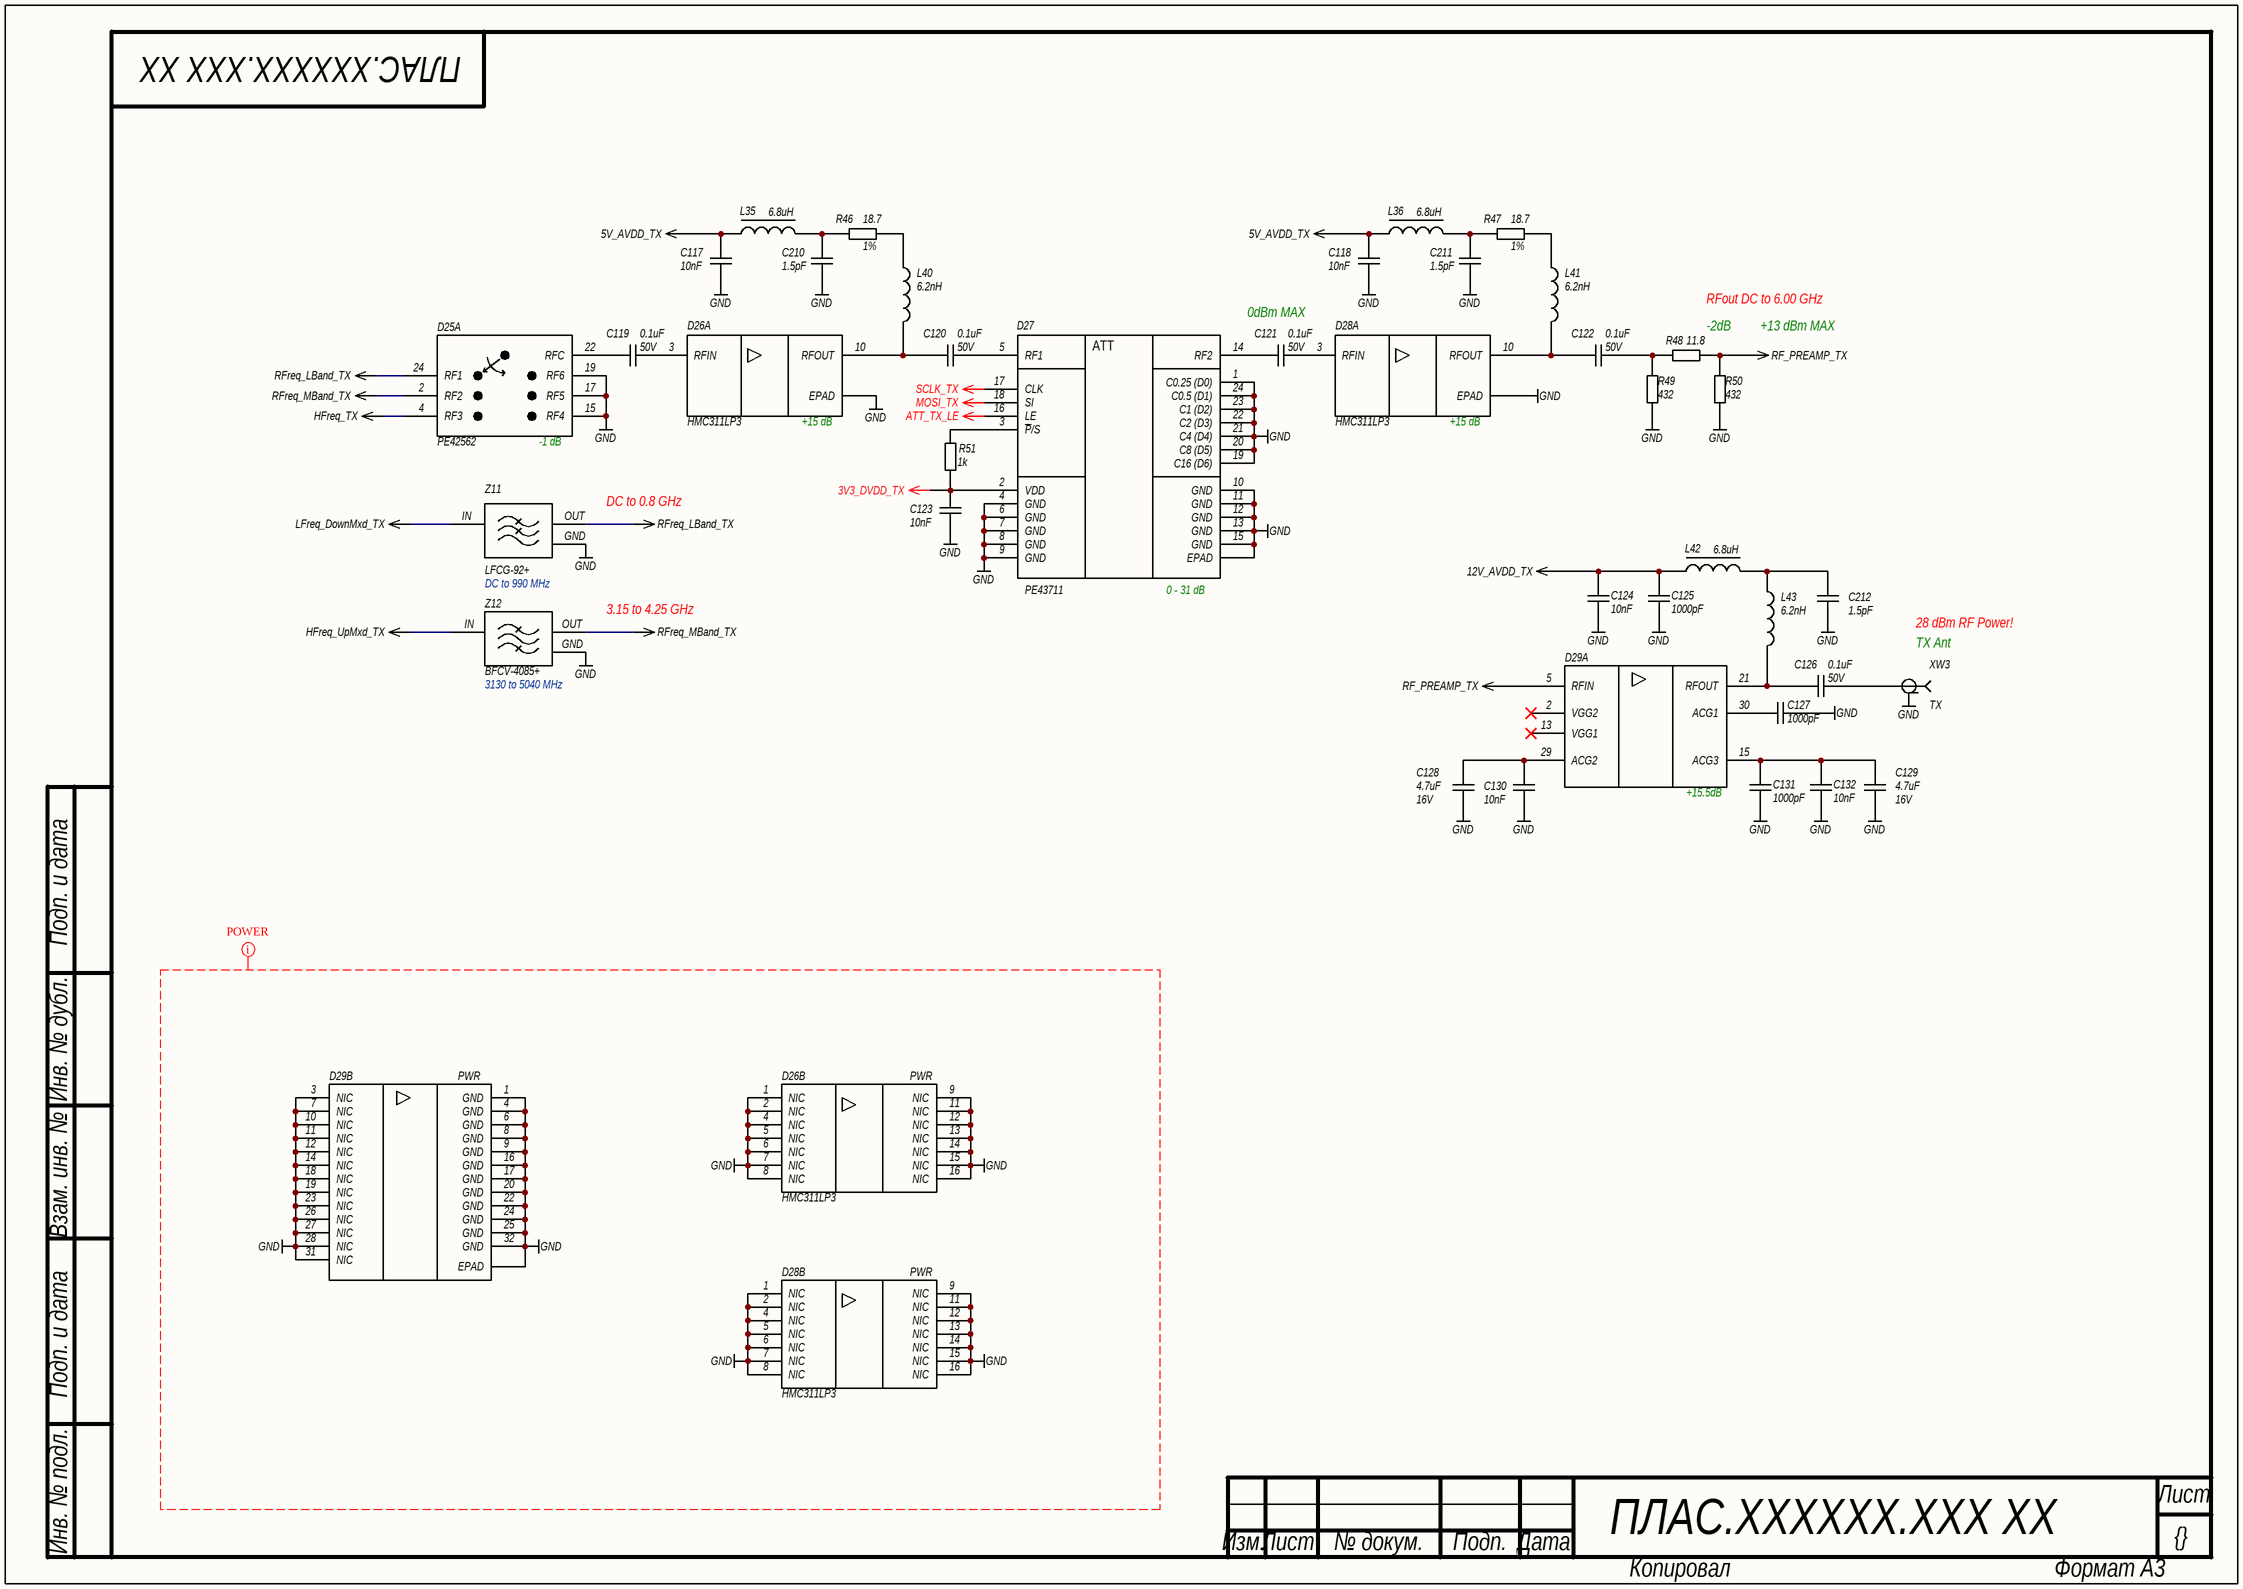
[diagram p3: TX.SchDoc]

### Parts
(Parts that share a designator on the sheet are numbered #1, #2 ... from top to bottom, then left to right.)
C117  value 10nF  [C0402]  (hidden comment: CAP)
C118  value 10nF  [C0402]  (hidden comment: CAP)
C119  value 0.1uF  Voltage: 50V  [C1206]  (hidden comment: CAP)
C120  value 0.1uF  Voltage: 50V  [C1206]  (hidden comment: CAP)
C121  value 0.1uF  Voltage: 50V  [C1206]  (hidden comment: CAP)
C122  value 0.1uF  Voltage: 50V  [C1206]  (hidden comment: CAP)
C123  value 10nF  [C0402]  (hidden comment: CAP)
C124  value 10nF  [C0402]  (hidden comment: CAP)
C125  value 1000pF  [C0402]  (hidden comment: CAP)
C126  value 0.1uF  Voltage: 50V  [C1206]  (hidden comment: CAP)
C127  value 1000pF  [C0402]  (hidden comment: CAP)
C128  value 4.7uF  Voltage: 16V  [C0603]  (hidden comment: CAP)
C129  value 4.7uF  Voltage: 16V  [C0603]  (hidden comment: CAP)
C130  value 10nF  [C0402]  (hidden comment: CAP)
C131  value 1000pF  [C0402]  (hidden comment: CAP)
C132  value 10nF  [C0402]  (hidden comment: CAP)
C210#2  value 1.5pF  [C0402]  (hidden comment: CAP)
C211#2  value 1.5pF  [C0402]  (hidden comment: CAP)
C212#2  value 1.5pF  [C0402]  (hidden comment: CAP)
D25  PE42562  [QFN-24]  (part A of 2)
D26  HMC311LP3  [QFN-16 v2]  (parts A,B of 2)
D27  PE43711  [QFN-24]
D28  HMC311LP3  [QFN-16 v2]  (parts A,B of 2)
D29  HMC637BPM5E  [LFCSP-32]  (value not drawn)  (parts A,B of 2)
L35  value 6.8uH  [XFL3012]  (hidden comment: Inductor)
L36  value 6.8uH  [XFL3012]  (hidden comment: Inductor)
L40  value 6.2nH  [L0805_HP]  (hidden comment: Inductor RF)
L41  value 6.2nH  [L0805_HP]  (hidden comment: Inductor RF)
L42  value 6.8uH  [XFL3012]  (hidden comment: Inductor)
L43  value 6.2nH  [L0805_HP]  (hidden comment: Inductor RF)
R46  value 18.7  Tolerance: 1%  [R0805]  (hidden comment: RES)
R47  value 18.7  Tolerance: 1%  [R0805]  (hidden comment: RES)
R48  value 11.8  [R0402]  (hidden comment: RES)
R49  value 432  [R0402]  (hidden comment: RES)
R50  value 432  [R0402]  (hidden comment: RES)
R51  value 1k  [R0402]  (hidden comment: RES)
XW3  TX  [MOLEX SD-73251-135 (Gold)]
Z11  LFCG-92+  Frequency: DC to 990 MHz  [GE0805C-2]
Z12  BFCV-4085+  Frequency: 3130 to 5040 MHz  [JV1210C]

### Nets
3V3_DVDD_TX: C123.2 D27.2(VDD) R51.1
5V_AVDD_TX: C117.2 C118.2 L35.1 L36.1
12V_AVDD_TX: C124.2 C125.2 L42.1
ATT_TX_LE: D27.16(LE)
GND: C117.1 C118.1 C123.1 C124.1 C125.1 C127.2 C128.2 C129.2 C130.1 C131.1 C132.1 C210#2.1 C211#2.1 C212#2.1 D25.15(RF4) D25.17(RF5) D25.19(RF6) D26.1(NIC) D26.2(NIC) D26.4(NIC) D26.5(NIC) D26.6(NIC) D26.7(NIC) D26.8(NIC) D26.9(NIC) D26.11(NIC) D26.12(NIC) D26.13(NIC) D26.14(NIC) D26.15(NIC) D26.16(NIC) D26.17(EPAD) D27.1(C0.25_(D0)) D27.4(GND) D27.6(GND) D27.7(GND) D27.8(GND) D27.9(GND) D27.10(GND) D27.11(GND) D27.12(GND) D27.13(GND) D27.15(GND) D27.19(C16_(D6)) D27.20(C8_(D5)) D27.21(C4_(D4)) D27.22(C2_(D3)) D27.23(C1_(D2)) D27.24(C0.5_(D1)) D27.25(EPAD) D28.1(NIC) D28.2(NIC) D28.4(NIC) D28.5(NIC) D28.6(NIC) D28.7(NIC) D28.8(NIC) D28.9(NIC) D28.11(NIC) D28.12(NIC) D28.13(NIC) D28.14(NIC) D28.15(NIC) D28.16(NIC) D28.17(EPAD) D29.0(EPAD) D29.1(GND) D29.3(NIC) D29.4(GND) D29.6(GND) D29.7(NIC) D29.8(GND) D29.9(GND) D29.10(NIC) D29.11(NIC) D29.12(NIC) D29.14(NIC) D29.16(GND) D29.17(GND) D29.18(NIC) D29.19(NIC) D29.20(GND) D29.22(GND) D29.23(NIC) D29.24(GND) D29.25(GND) D29.26(NIC) D29.27(NIC) D29.28(NIC) D29.31(NIC) D29.32(GND) R49.2 R50.2 XW3.G(GND) Z11.GND Z12.GND
HFreq_TX: D25.4(RF3)
HFreq_UpMxd_TX: Z12.IN
LFreq_DownMxd_TX: Z11.IN
MOSI_TX: D27.18(SI)
RF_PREAMP_TX: D29.5(RFIN) R48.1 R50.1
RFreq_LBand_TX: D25.24(RF1) Z11.OUT
RFreq_MBand_TX: D25.2(RF2) Z12.OUT
SCLK_TX: D27.17(CLK)
NetC119_1: C119.1 D26.3(RFIN)
NetC119_2: C119.2 D25.22(RFC)
NetC120_1: C120.1 D27.5(RF1)
NetC120_2: C120.2 D26.10(RFOUT) L40.1
NetC121_1: C121.1 D28.3(RFIN)
NetC121_2: C121.2 D27.14(RF2)
NetC122_1: C122.1 R48.2 R49.1
NetC122_2: C122.2 D28.10(RFOUT) L41.1
NetC126_1: C126.1 XW3.S(RF)
NetC126_2: C126.2 D29.21(RFOUT) L43.1
NetC127_1: C127.1 D29.30(ACG1)
NetC128_1: C128.1 C130.2 D29.29(ACG2)
NetC129_1: C129.1 C131.2 C132.2 D29.15(ACG3)
NetC210#2_2: C210#2.2 L35.2 R46.2
NetC211#2_2: C211#2.2 L36.2 R47.2
NetC212#2_2: C212#2.2 L42.2 L43.2
NetD27_3: D27.3(~{P}/S) R51.2
NetL40_2: L40.2 R46.1
NetL41_2: L41.2 R47.1

Not connected (* = marked no-connect by the designer): D29 2(VGG2)* 13(VGG1)*

### Layout directives
net class POWER: GND

### Notes on the sheet
- 0dBm MAX
- RFout DC to 6.00 GHz
- (near R48) -2dB
- +13 dBm MAX
- DC to 0.8 GHz
- 3.15 to 4.25 GHz
- (near XW3) TX Ant
- 28 dBm RF Power!
- Подп. и дата
- Инв. № дубл.
- Взам. инв. №
- Инв. № подл.
- Лист
- Изм.
- № докум.
- Подп.
- Дата
- Копировал
- Формат А3
- (in symbol HMC311LP3, part A) +15 dB
- (in symbol HMC311LP3, part B) PWR
- (in symbol HMC637BPM5E, part A) +15.5dB
- (in symbol HMC637BPM5E, part B) PWR
- (in symbol PE42562, part A) -1 dB
- (in symbol PE43711) ATT; 0 - 31 dB

### Library data of the parts
C117 C118 C123 C124 C130 C132 = CAP: as C9 on sheet DBoard_conn
C119-C122 C126 = CAP: SMD Capacitor; Manufacturer: Murata; Material: NP0; Tolerance: 5%; Type: Ceramic Capacitor; P/N: GRM31C5C1H104JA01K
C125 C127 C131 = CAP: as C95 on sheet IF_TX
C128 C129 = CAP: SMD Capacitor; Manufacturer: Murata; Material: X5R; Tolerance: 10%; Type: Ceramic Capacitor; P/N: GRM188R61C475KAAJD
C210#2 C211#2 C212#2 = CAP: SMD Capacitor; Manufacturer: Murata; Material: NP0; Tolerance: ±0.05pF; Voltage: 50V; Type: Ceramic Capacitor; P/N: GRM1555C1H1R5WA01D
D25 = PE42562: as D21 on sheet IF_TX; Name: PE42562; Package: 24-lead 4 × 4 × 0.85 mm QFN; Type: Absorptive SP6T RF switch
D26 D28 = HMC311LP3: InGaP HBT GAIN BLOCK; Manufacturer: Analog Devices; P/N: HMC311LP3E; Name: HMC311LP3; Package: 16 Lead 3x3mm SMT; Type: GAIN BLOCK
D27 = PE43711: The PE43711 is a 50Ω, HaRP™ technology-enhanced, 7-bit RF digital step attenuator; Manufacturer: Peregrine Technical Solutions; P/N: PE43711A-Z; Type: 7-bit RF digital step attenuator (DSA); Name: PE43711; Package: 24-lead 4 × 4 × 0.85 mm QFN; Supplier 1: Digi-Key; Supplier Part Number 1: 1046-1138-1-ND
D29 = HMC637BPM5E: 1 W Power Amplifier; Manufacturer: Analog Devices; Voltage: 12 V at 345 mA typical; Package: 32-lead, 5 mm × 5 mm LFCSP; Temperature Range: -40°C ~ 105°C; Type: Power Amplifier; P/N: HMC637BPM5E; Name: HMC637BPM5E
L35 L36 L42 = Inductor: Chip SMD Inductor; Manufacturer: Coilcraft; Current: 0.61A; Frequency: 39.9MHz; Name: XFL3012-682ME; Tolerance: ±5%; Series: XFL3012; Temperature Range: -25…85°C; P/N: XFL3012-682ME
L40 L41 L43 = Inductor RF: Chip SMD Inductor; Manufacturer: Coilcraft; Current: 1.5A; Frequency: 7200MHz; Name: 0805HP-6N2XJR; Tolerance: 5%; Series: 0805HP; Temperature Range: -25…85°C; P/N: 0805HP-6N2XJR
R46 R47 = RES: SMD Resistor; Manufacturer: Panasonic Electronic Components; Name: Chip SMD Resistor; Power: 0.125 Wt; P/N: ERJ-6ENF18R7V; Temperature Range: -55…155°C
R48 = RES: as R39 on sheet IF_TX; Temperature Range: -55…155°C
R49 R50 = RES: as R40 on sheet IF_TX; Temperature Range: -55…155°C
R51 = RES: SMD Resistor; Name: Chip SMD Resistor; Power: 0.062 Wt; Tolerance: 5%; P/N: ERJ-2GEJ102X; Temperature Range: -55…155°C
XW3 = RF Connector: 50 Ohms, SMA Jack, Vertica; Manufacturer: Molex; Impedance: 50Ω; P/N: 0732511352; Name: SMA Jack; Type: 50 Ohms, SMA Jack, Vertical, PCB SMT, Gold (Au) Body; Supplier 1: Digi-Key; Supplier Part Number 1: WM9458-ND
Z11 = LFCG-92+: as Z10 on sheet IF_TX; Name: LFCG-92+; P/N: LFCG-92+; Type: Low Pass Filter; Package: GE0805C-2
Z12 = BFCV-4085+: Bandpass Filter; Manufacturer: Mini-Circuits; Name: BFCV-4085+; P/N: BFCV-4085+; Type: Bandpass Filter; Package: JV1210C

## Sheet REFCLK.SchDoc: {Наименование}
size 420 x 297 mm; DocumentNumber: ПЛАС.ХХХХХХ.ХХХ ХХ; SheetNumber: {}; SheetTotal: {}; PageSetup: Record=PageOptions|CenterHorizontal=False|CenterVertical=False|PrintScale=0.95|XCorrection=0.00|YCorrection=0.00|PrintKind=1|BorderSize=5000000|LeftOffset=0|BottomOffset=0|Orientation=1|PaperLength=1000|PaperWidth=1000|Scale=100|PaperSource=15|PrintQuality=600|MediaType=1|DitherType=10|PaperKind=A4|PrintScaleMode=1; Rule: PcbType=ProtelPcb
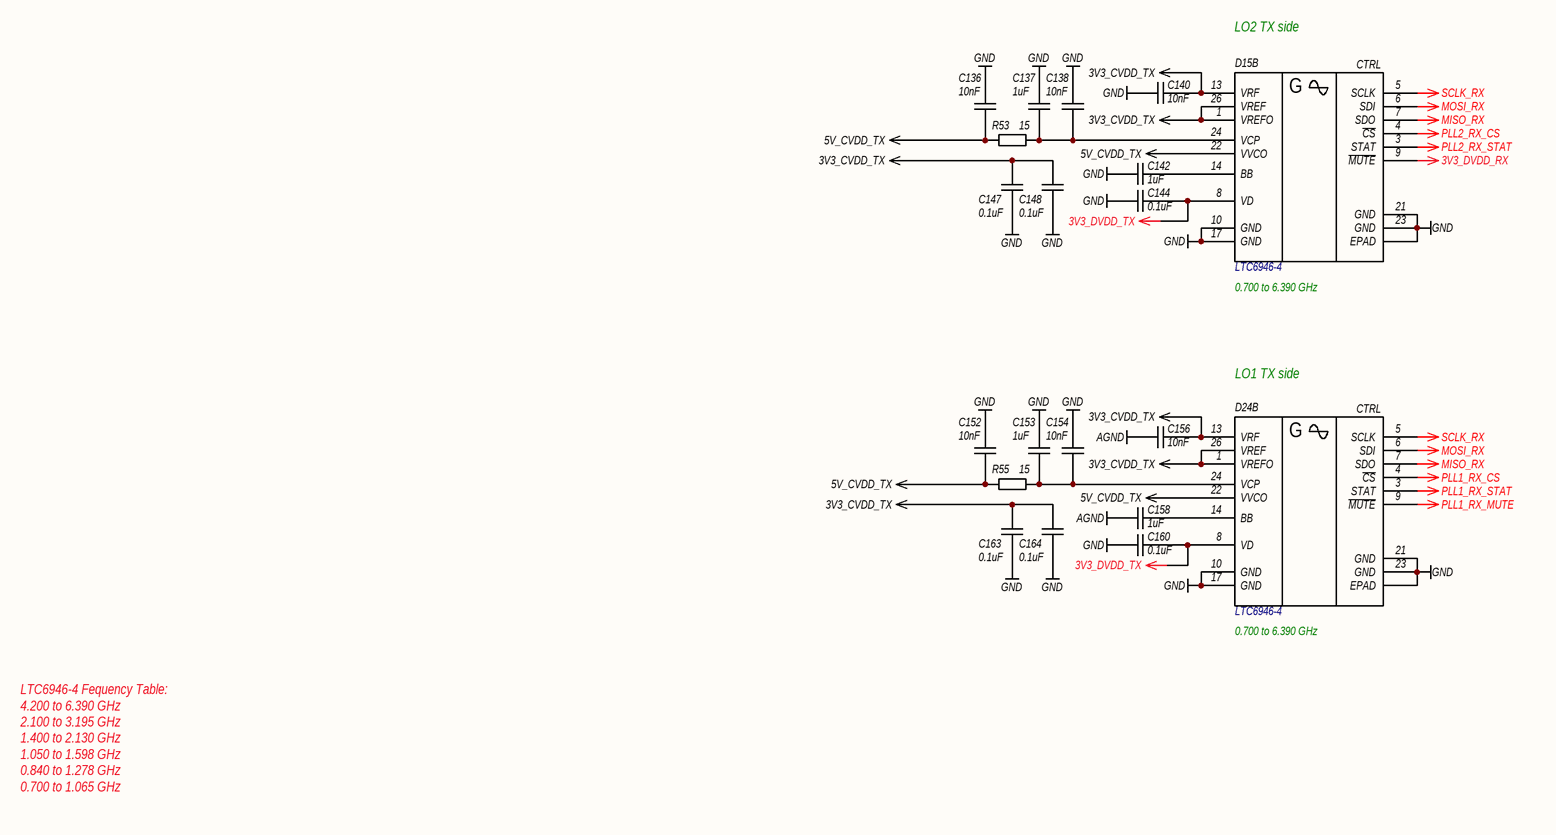
[diagram p4: REFCLK.SchDoc]

### Parts
C136  value 10nF  [C0402]  (hidden comment: CAP)
C137  value 1uF  [C0805]  (hidden comment: CAP)
C138  value 10nF  [C0402]  (hidden comment: CAP)
C140  value 10nF  [C0402]  (hidden comment: CAP)
C142  value 1uF  [C0805]  (hidden comment: CAP)
C144  value 0.1uF  [C0402]  (hidden comment: CAP)
C147  value 0.1uF  [C0402]  (hidden comment: CAP)
C148  value 0.1uF  [C0402]  (hidden comment: CAP)
C152  value 10nF  [C0402]  (hidden comment: CAP)
C153  value 1uF  [C0805]  (hidden comment: CAP)
C154  value 10nF  [C0402]  (hidden comment: CAP)
C156  value 10nF  [C0402]  (hidden comment: CAP)
C158  value 1uF  [C0805]  (hidden comment: CAP)
C160  value 0.1uF  [C0402]  (hidden comment: CAP)
C163  value 0.1uF  [C0402]  (hidden comment: CAP)
C164  value 0.1uF  [C0402]  (hidden comment: CAP)
D15  Name: LTC6946-4  Frequency Range: 0.700 to 6.390 GHz  [QFN-28]  (hidden comment: LTC6946)  (part B of 2)
D24  Name: LTC6946-4  Frequency Range: 0.700 to 6.390 GHz  [QFN-28]  (hidden comment: LTC6946)  (part B of 2)
R53  value 15  [R0603]  (hidden comment: RES)
R55  value 15  [R0603]  (hidden comment: RES)

### Nets
3V3_CVDD_TX: C140.1 C147.2 C148.2 C156.1 C163.2 C164.2 D15.1(VREFO) D15.13(VRF) D15.26(VREF) D24.1(VREFO) D24.13(VRF) D24.26(VREF)
3V3_DVDD_RX: D15.9(~{MUTE})
3V3_DVDD_TX: C144.2 C160.2 D15.8(VD) D24.8(VD)
5V_CVDD_TX: C136.2 C152.2 D15.22(VVCO) D24.22(VVCO) R53.2 R55.2
AGND: C156.2 C158.2
GND: C136.1 C137.1 C138.1 C140.2 C142.2 C144.1 C147.1 C148.1 C152.1 C153.1 C154.1 C160.1 C163.1 C164.1 D15.10(GND) D15.17(GND) D15.21(GND) D15.23(GND) D15.29(EPAD) D24.10(GND) D24.17(GND) D24.21(GND) D24.23(GND) D24.29(EPAD)
MISO_RX: D15.7(SDO) D24.7(SDO)
MOSI_RX: D15.6(SDI) D24.6(SDI)
PLL1_RX_CS: D24.4(~{CS})
PLL1_RX_MUTE: D24.9(~{MUTE})
PLL1_RX_STAT: D24.3(STAT)
PLL2_RX_CS: D15.4(~{CS})
PLL2_RX_STAT: D15.3(STAT)
SCLK_RX: D15.5(SCLK) D24.5(SCLK)
NetC137_2: C137.2 C138.2 D15.24(VCP) R53.1
NetC142_1: C142.1 D15.14(BB)
NetC153_2: C153.2 C154.2 D24.24(VCP) R55.1
NetC158_1: C158.1 D24.14(BB)

### Notes on the sheet
- LO2 TX side
- LO1 TX side
- LTC6946-4 Fequency Table:
  4.200 to 6.390 GHz
  2.100 to 3.195 GHz
  1.400 to 2.130 GHz
  1.050 to 1.598 GHz
  0.840 to 1.278 GHz
  0.700 to 1.065 GHz
- Подп. и дата
- Инв. № дубл.
- Взам. инв. №
- Инв. № подл.
- Лист
- Изм.
- № докум.
- Подп.
- Дата
- Копировал
- Формат А3
- (in symbol LTC6946, part B) CTRL; G

### Library data of the parts
C136 C138 C140 C152 C154 C156 = CAP: as C9 on sheet DBoard_conn
C137 C142 C153 C158 = CAP: as C92 on sheet IF_TX
C144 C147 C148 C160 C163 C164 = CAP: as C82 on sheet IF_TX
D15 D24 = LTC6946: as D23 on sheet IF_TX; Package: 28-QFN (4x5); Temperature Range: -40°C ~ 105°C; Supplier 1: Digi-Key; Supplier Part Number 1: LTC6946IUFD-4#PBF-ND
R53 R55 = RES: SMD Resistor; Name: Chip SMD Resistor; Power: 0.1 Wt; Tolerance: 1%; P/N: ERJ-3EKF15R0V; Temperature Range: -55…155°C

## Sheet Digital.SchDoc: {Наименование}
size 420 x 297 mm; DocumentNumber: ПЛАС.ХХХХХХ.ХХХ ХХ; SheetNumber: {}; SheetTotal: {}; PageSetup: Record=PageOptions|CenterHorizontal=False|CenterVertical=False|PrintScale=0.95|XCorrection=0.00|YCorrection=0.00|PrintKind=1|BorderSize=5000000|LeftOffset=0|BottomOffset=0|Orientation=1|PaperLength=1000|PaperWidth=1000|Scale=100|PaperSource=15|PrintQuality=600|MediaType=1|DitherType=10|PaperKind=A4|PrintScaleMode=1; Rule: PcbType=ProtelPcb
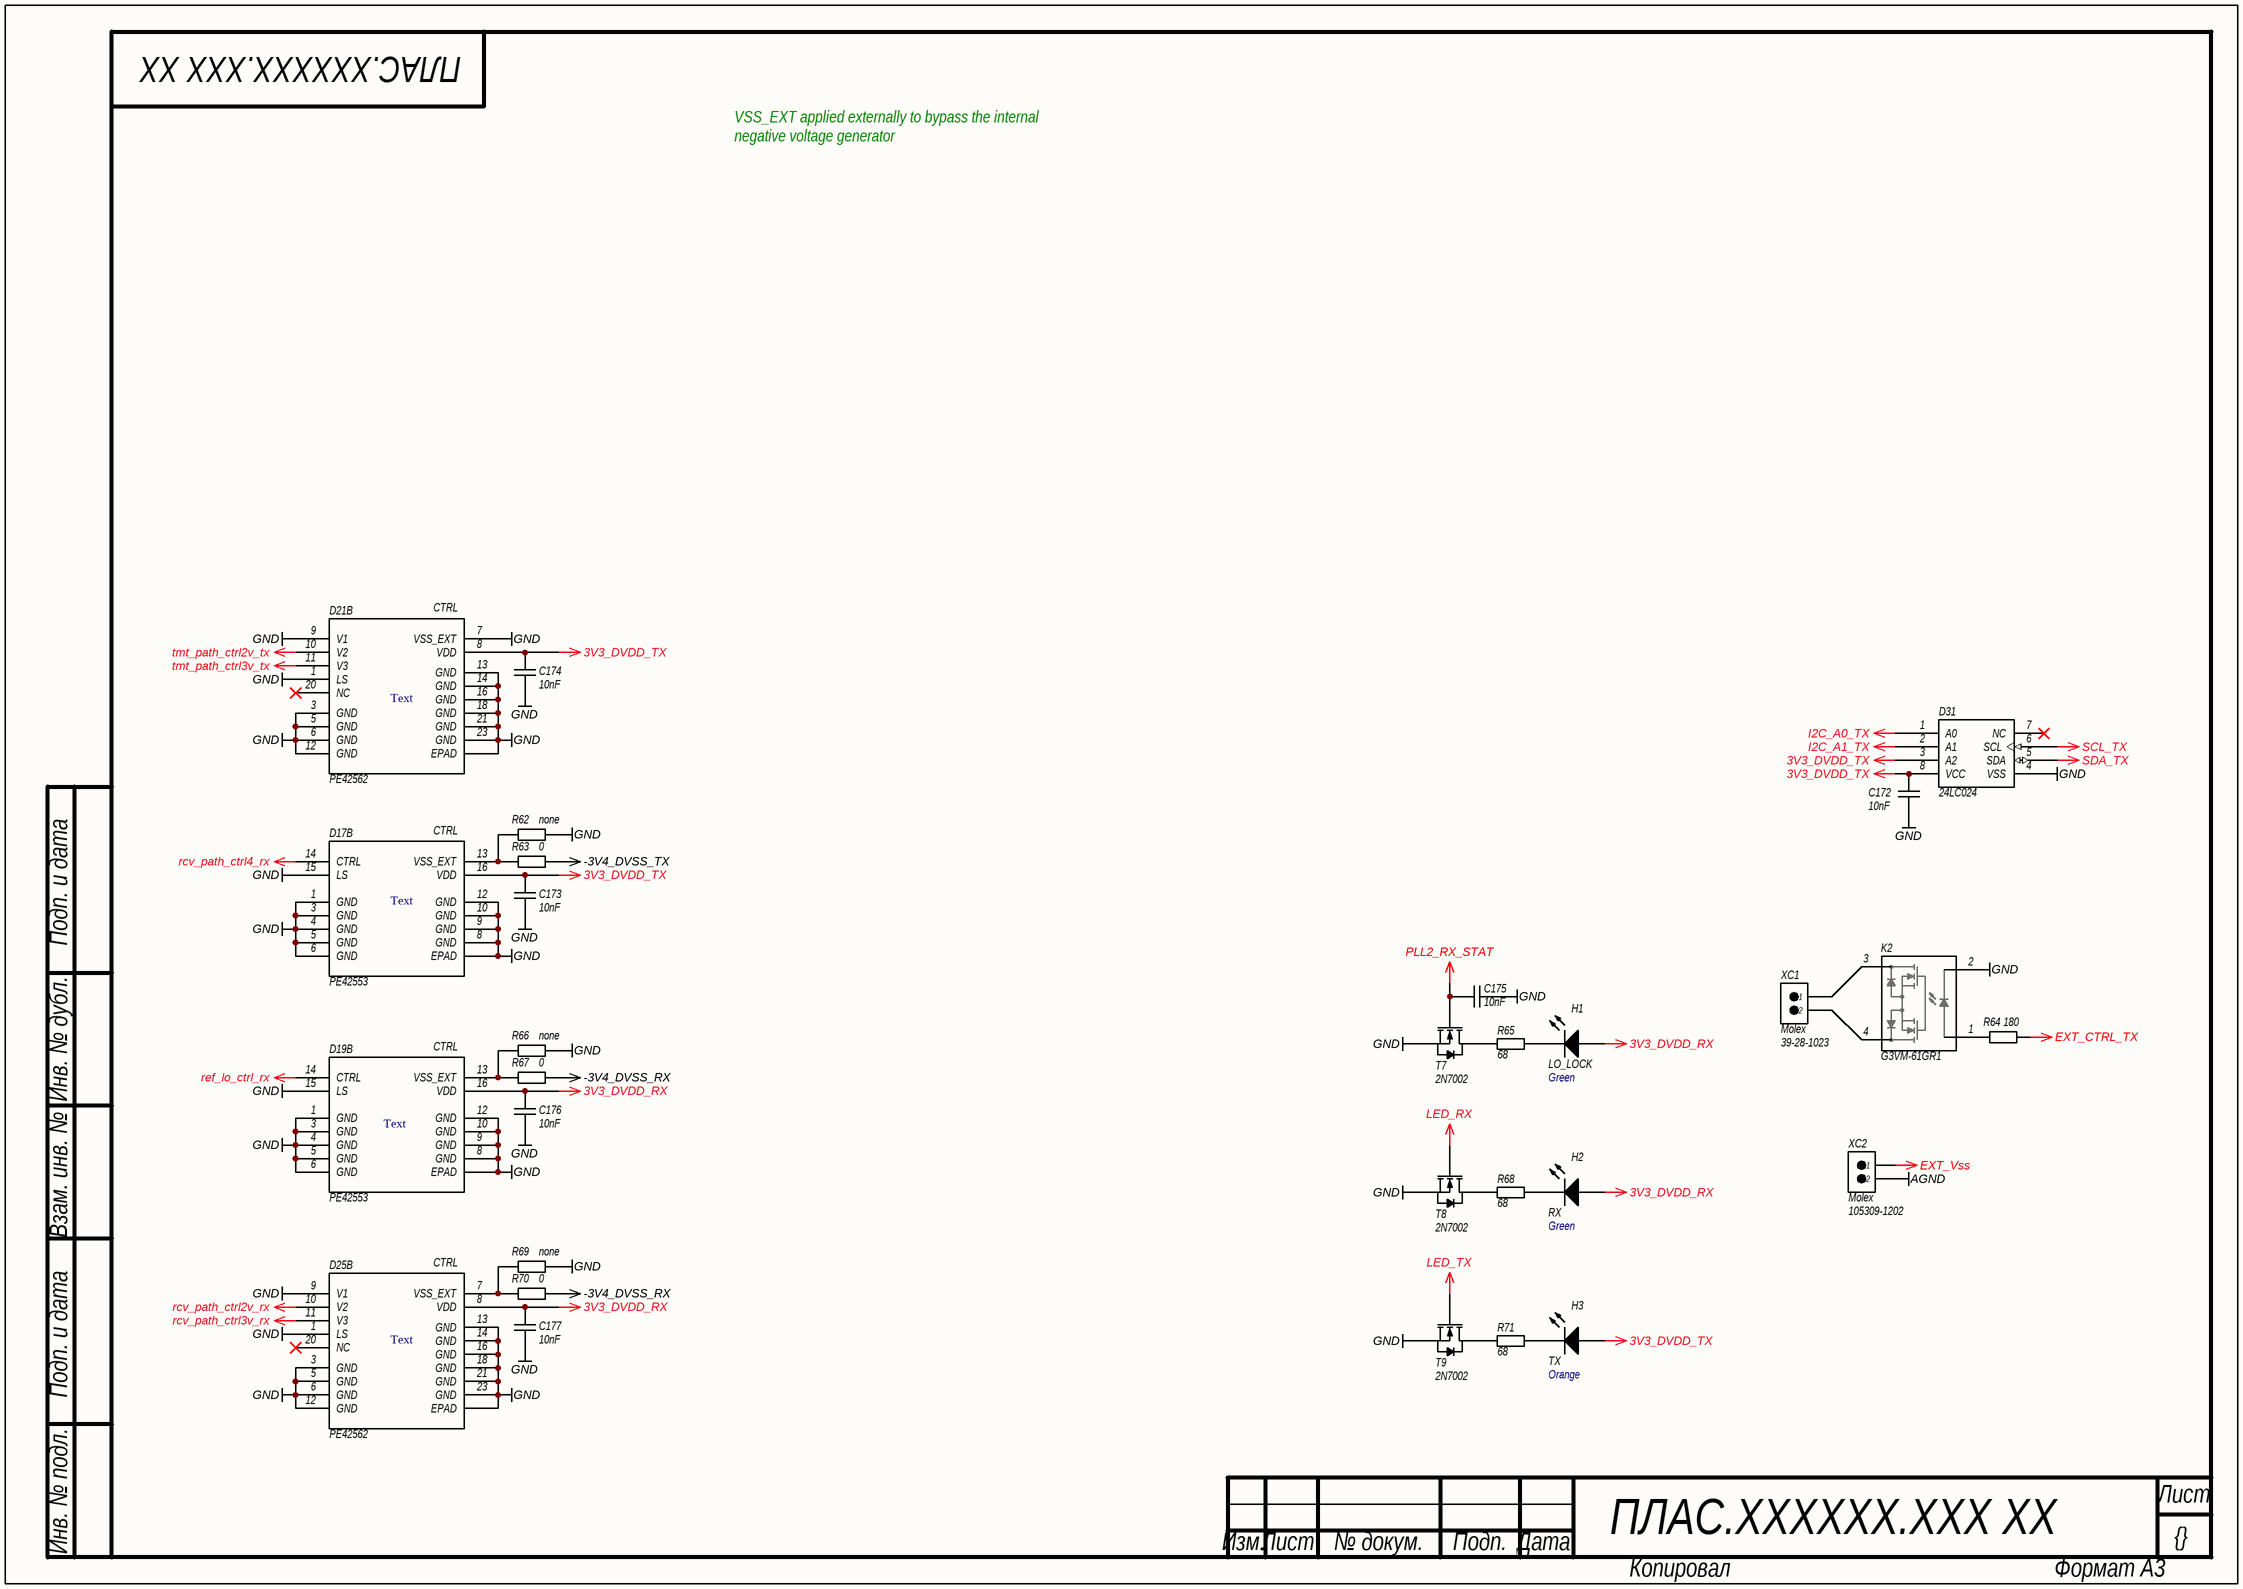
[diagram p5: Digital.SchDoc]

### Parts
(Parts that share a designator on the sheet are numbered #1, #2 ... from top to bottom, then left to right.)
C172  value 10nF  [C0402]  (hidden comment: CAP)
C173  value 10nF  [C0402]  (hidden comment: CAP)
C174  value 10nF  [C0402]  (hidden comment: CAP)
C175  value 10nF  [C0402]  (hidden comment: CAP)
C176  value 10nF  [C0402]  (hidden comment: CAP)
C177  value 10nF  [C0402]  (hidden comment: CAP)
D17#2  PE42553  [QFN-16]  (part B of 2)
D19  PE42553  [QFN-16]  (part B of 2)
D21  PE42562  [QFN-24]  (part B of 2)
D25  PE42562  [QFN-24]  (part B of 2)
D31  24LC024  [SOIC_SN8]
H1  LO_LOCK  Color: Green  [LED]
H2  RX  Color: Green  [LED]
H3  TX  Color: Orange  [LED]
K2  G3VM-61GR1  [G3VM-61]
R62  value none  [R0603]  (hidden comment: RES)
R63  value 0  [R0603]  (hidden comment: RES)
R64  value 180  [R0402]  (hidden comment: RES)
R65  value 68  [R0402]  (hidden comment: RES)
R66  value none  [R0603]  (hidden comment: RES)
R67  value 0  [R0603]  (hidden comment: RES)
R68  value 68  [R0402]  (hidden comment: RES)
R69  value none  [R0603]  (hidden comment: RES)
R70  value 0  [R0603]  (hidden comment: RES)
R71  value 68  [R0402]  (hidden comment: RES)
T7  2N7002  [SOT-23]
T8  2N7002  [SOT-23]
T9  2N7002  [SOT-23]
XC1  Manufacturer: Molex  P/N: 39-28-1023  [Mini-Fit Jr. Vertical Header]  (hidden comment: Mini-Fit Jr. Vertical Header)
XC2  Manufacturer: Molex  P/N: 105309-1202  [Nano-Fit Vertical Header]  (hidden comment: Nano-Fit Vertical Header)

### Nets
3V3_DVDD_RX: C176.1 C177.1 D19.16(VDD) D25.8(VDD) H1.2(A) H2.2(A)
3V3_DVDD_TX: C172.2 C173.1 C174.1 D17#2.16(VDD) D21.8(VDD) D31.3(A2) D31.8(VCC) H3.2(A)
-3V4_DVSS_RX: R67.1 R70.1
-3V4_DVSS_TX: R63.1
AGND: XC2.2
EXT_CTRL_TX: R64.2
EXT_Vss: XC2.1
GND: C172.1 C173.2 C174.2 C175.2 C176.2 C177.2 D17#2.1(GND) D17#2.3(GND) D17#2.4(GND) D17#2.5(GND) D17#2.6(GND) D17#2.8(GND) D17#2.9(GND) D17#2.10(GND) D17#2.12(GND) D17#2.15(LS) D17#2.17(EPAD) D19.1(GND) D19.3(GND) D19.4(GND) D19.5(GND) D19.6(GND) D19.8(GND) D19.9(GND) D19.10(GND) D19.12(GND) D19.15(LS) D19.17(EPAD) D21.1(LS) D21.3(GND) D21.5(GND) D21.6(GND) D21.7(VSS_EXT) D21.9(V1) D21.12(GND) D21.13(GND) D21.14(GND) D21.16(GND) D21.18(GND) D21.21(GND) D21.23(GND) D21.25(EPAD) D25.1(LS) D25.3(GND) D25.5(GND) D25.6(GND) D25.9(V1) D25.12(GND) D25.13(GND) D25.14(GND) D25.16(GND) D25.18(GND) D25.21(GND) D25.23(GND) D25.25(EPAD) D31.4(VSS) K2.2 R62.2 R66.2 R69.2 T7.2(S) T8.2(S) T9.2(S)
I2C_A0_TX: D31.1(A0)
I2C_A1_TX: D31.2(A1)
LED_RX: T8.1(G)
LED_TX: T9.1(G)
PLL2_RX_STAT: C175.1 T7.1(G)
rcv_path_ctrl2v_rx: D25.10(V2)
rcv_path_ctrl3v_rx: D25.11(V3)
rcv_path_ctrl4_rx: D17#2.14(CTRL)
ref_lo_ctrl_rx: D19.14(CTRL)
SCL_TX: D31.6(SCL)
SDA_TX: D31.5(SDA)
tmt_path_ctrl2v_tx: D21.10(V2)
tmt_path_ctrl3v_tx: D21.11(V3)
NetD17#2_13: D17#2.13(VSS_EXT) R62.1 R63.2
NetD19_13: D19.13(VSS_EXT) R66.1 R67.2
NetD25_7: D25.7(VSS_EXT) R69.1 R70.2
NetH1_1: H1.1(K) R65.2
NetH2_1: H2.1(K) R68.2
NetH3_1: H3.1(K) R71.1
NetK2_1: K2.1 R64.1
NetK2_3: K2.3 XC1.1
NetK2_4: K2.4 XC1.2
NetR65_1: R65.1 T7.3(D)
NetR68_1: R68.1 T8.3(D)
NetR71_2: R71.2 T9.3(D)

Not connected (* = marked no-connect by the designer): D21 20(NC)*; D25 20(NC)*; D31 7(NC)*

### Notes on the sheet
- VSS_EXT applied externally to bypass the internal
  negative voltage generator
- (near D21) Text
- (near D17#2) Text
- (near D19) Text
- (near D25) Text
- Подп. и дата
- Инв. № дубл.
- Взам. инв. №
- Инв. № подл.
- Лист
- Изм.
- № докум.
- Подп.
- Дата
- Копировал
- Формат А3
- (in symbol PE42562, part B) CTRL

### Library data of the parts
C172-C177 = CAP: as C9 on sheet DBoard_conn
D17#2 D19 = PE42553: as D17#2 on sheet IF_TX; Name: PE42553; Package: 16-lead 3 × 3 mm QFN; Supplier 1: Digi-Key; Supplier Part Number 1: 1046-1137-1-ND
D21 D25 = PE42562: as D21 on sheet IF_TX; Name: PE42562; Package: 24-lead 4 × 4 × 0.85 mm QFN; Type: Absorptive SP6T RF switch
D31 = 24LC024: I2C EEPROM; Manufacturer: Microchip; Capacity: 2kbit; Max Clock: 400 kHz; Voltage: 2.5-5.5V; Name: 24LC024; Package: SOIC-8; Type: I2C EEPROM
H1 H2 = LED: CHIP LED LAMP; Manufacturer: Kingbright; Name: APHCM2012; P/N: APHCM2012CGCK-F01; Package: 2.0 x 1.25 mm SMD; Type: CHIP LED LAMP; Supplier 1: Digi-Key; Supplier Part Number 1: 754-1094-1-ND
H3 = LED: CHIP LED LAMP; Manufacturer: Kingbright; Name: APHCM2012; P/N: APHCM2012SECK-F01; Package: 2.0 x 1.25 mm SMD; Type: CHIP LED LAMP
K2 = G3VM-61GR1: MOS FET Relay; Manufacturer: Omron; Channel Resistance: 700 mOhm; Current: 1A; Voltage: 60V; Name: G3VM-61GR1; Package: SOT-23F; P/N: G3VM-61GR1; Supplier 1: Digi-Key; Supplier Part Number 1: Z4069CT-ND
R62 R63 R66 R67 R69 R70 = RES: SMD Resistor; Name: Chip SMD Resistor; Power: 0.1 Wt; Tolerance: 1%; P/N: ERJ-2GE0R00X; Temperature Range: -55…155°C
R64 = RES: SMD Resistor; Manufacturer: Panasonic Electronic Components; Name: Chip SMD Resistor; Power: 0.063 Wt; Tolerance: 1%; P/N: ERJ-2RKF1800X; Temperature Range: -55…155°C
R65 R68 R71 = RES: SMD Resistor; Name: Chip SMD Resistor; Power: 0.062 Wt; Tolerance: 5%; P/N: ERJ-2GEJ680X; Temperature Range: -55…155°C
T7-T9 = 2N7002: N-Channel MOSFET 2N7002; Channel Resistance: 5Ohm; Current: 300mA; Power Dissipation: 0.83W; Voltage: 60V; Name: 2N7002; Type: SOT-23; Package: SOT-23
XC1 = Mini-Fit Jr. Vertical Header: 4.20mm Pitch, Dual Row, 2 Circuits, without Snap-in Plastic Peg PCB Lock; Mate With Series: 5557; Name: Mini-Fit Jr. Vertical Header; Series: 5566; Type: Mini-Fit Jr. Vertical Header, 4.20mm Pitch, Dual Row, 2 Circuits, without Snap-in Plastic Peg PCB Lock; Mate With P/N: 39-01-2020
XC2 = Nano-Fit Power Connector: Through Hole, 2.50mm Pitch, Single Row, 2 Circuits; Mate With P/N: 105307-1202; Mate With Series: 105307; Name: Nano-Fit Vertical Header; Series: 105309; Type: Vertical Header, Through Hole, 2.50mm Pitch